# Altium project Player.PrjPcb (part 1 of 2)
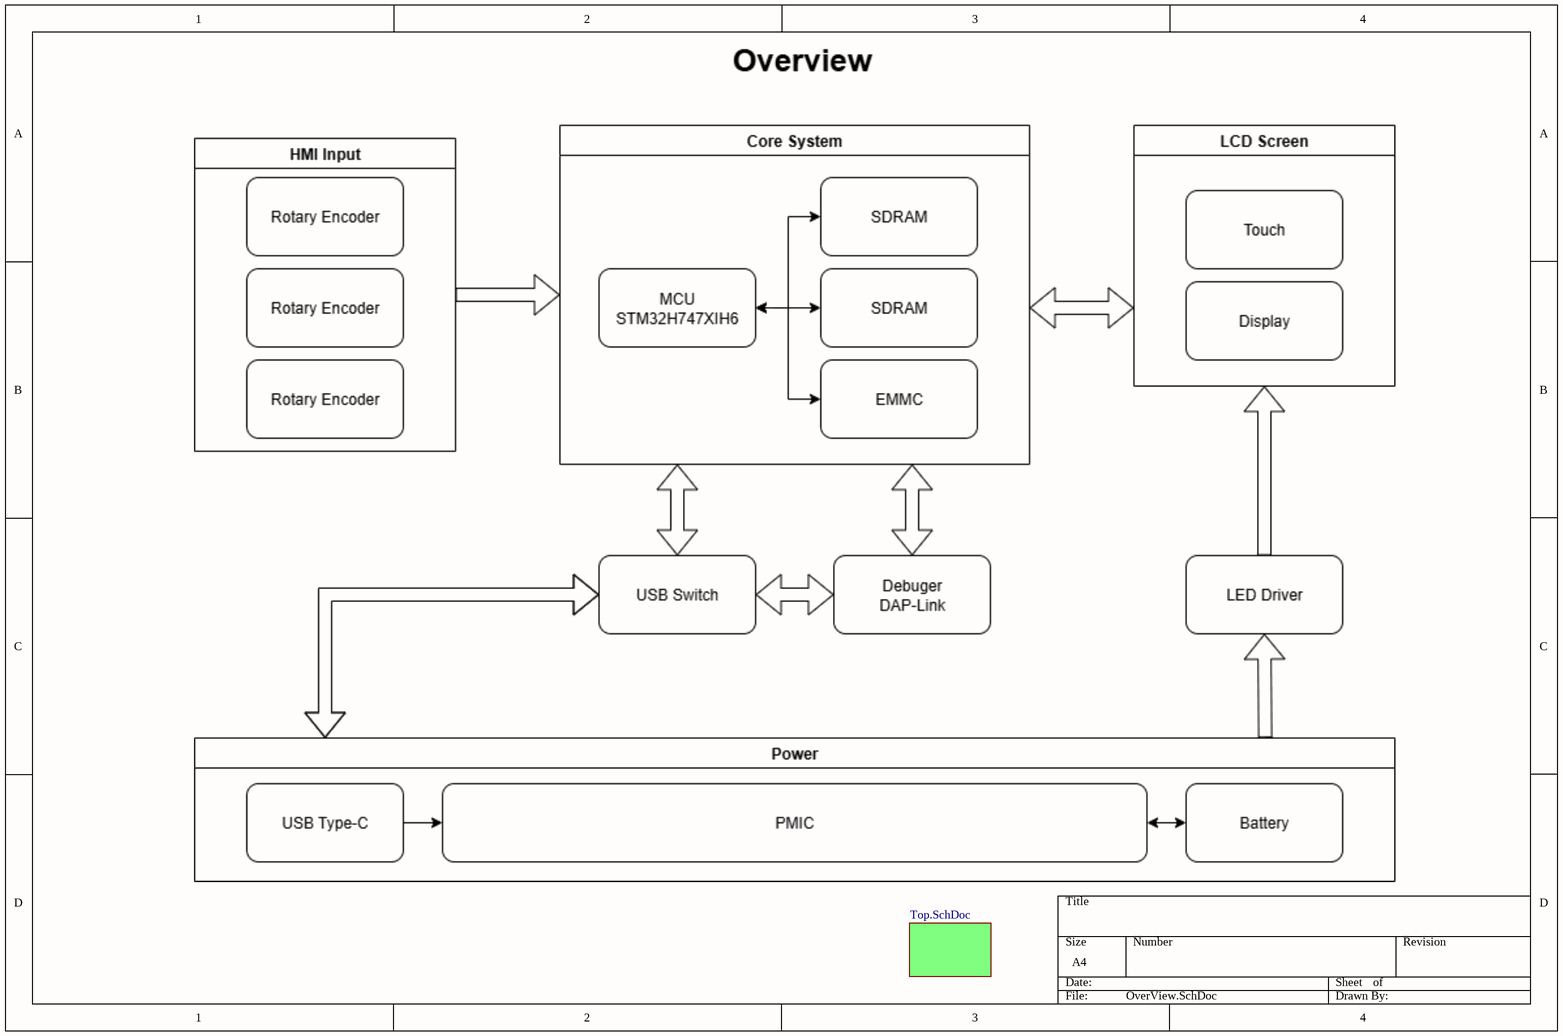
[diagram p0: OverView.SchDoc]
7 sheets, 265 parts. Net scope: flat (ports and power ports of the same name join across sheets).
Board files: Player.PcbDoc, Board.PcbDoc
Sheets:
  OverView.SchDoc
    Designator = Top.SchDoc
      MCU = MCU.SchDoc
      Analog Front End = AFE.SchDoc
      U_Nor Flash = Nor Flash QSPI.SchDoc
      U_EMMC = EMMC.SchDoc
      Audio I/V = Audio-HiFi.SchDoc
      Audio I/V = Audio-HiFi.SchDoc

## Sheet OverView.SchDoc
size A4; SheetNumber: 1; SheetTotal: 15

### Sub-sheets
Designator = Top.SchDoc: no entries

## Sheet Top.SchDoc
size A2; SheetNumber: 2; SheetTotal: 9
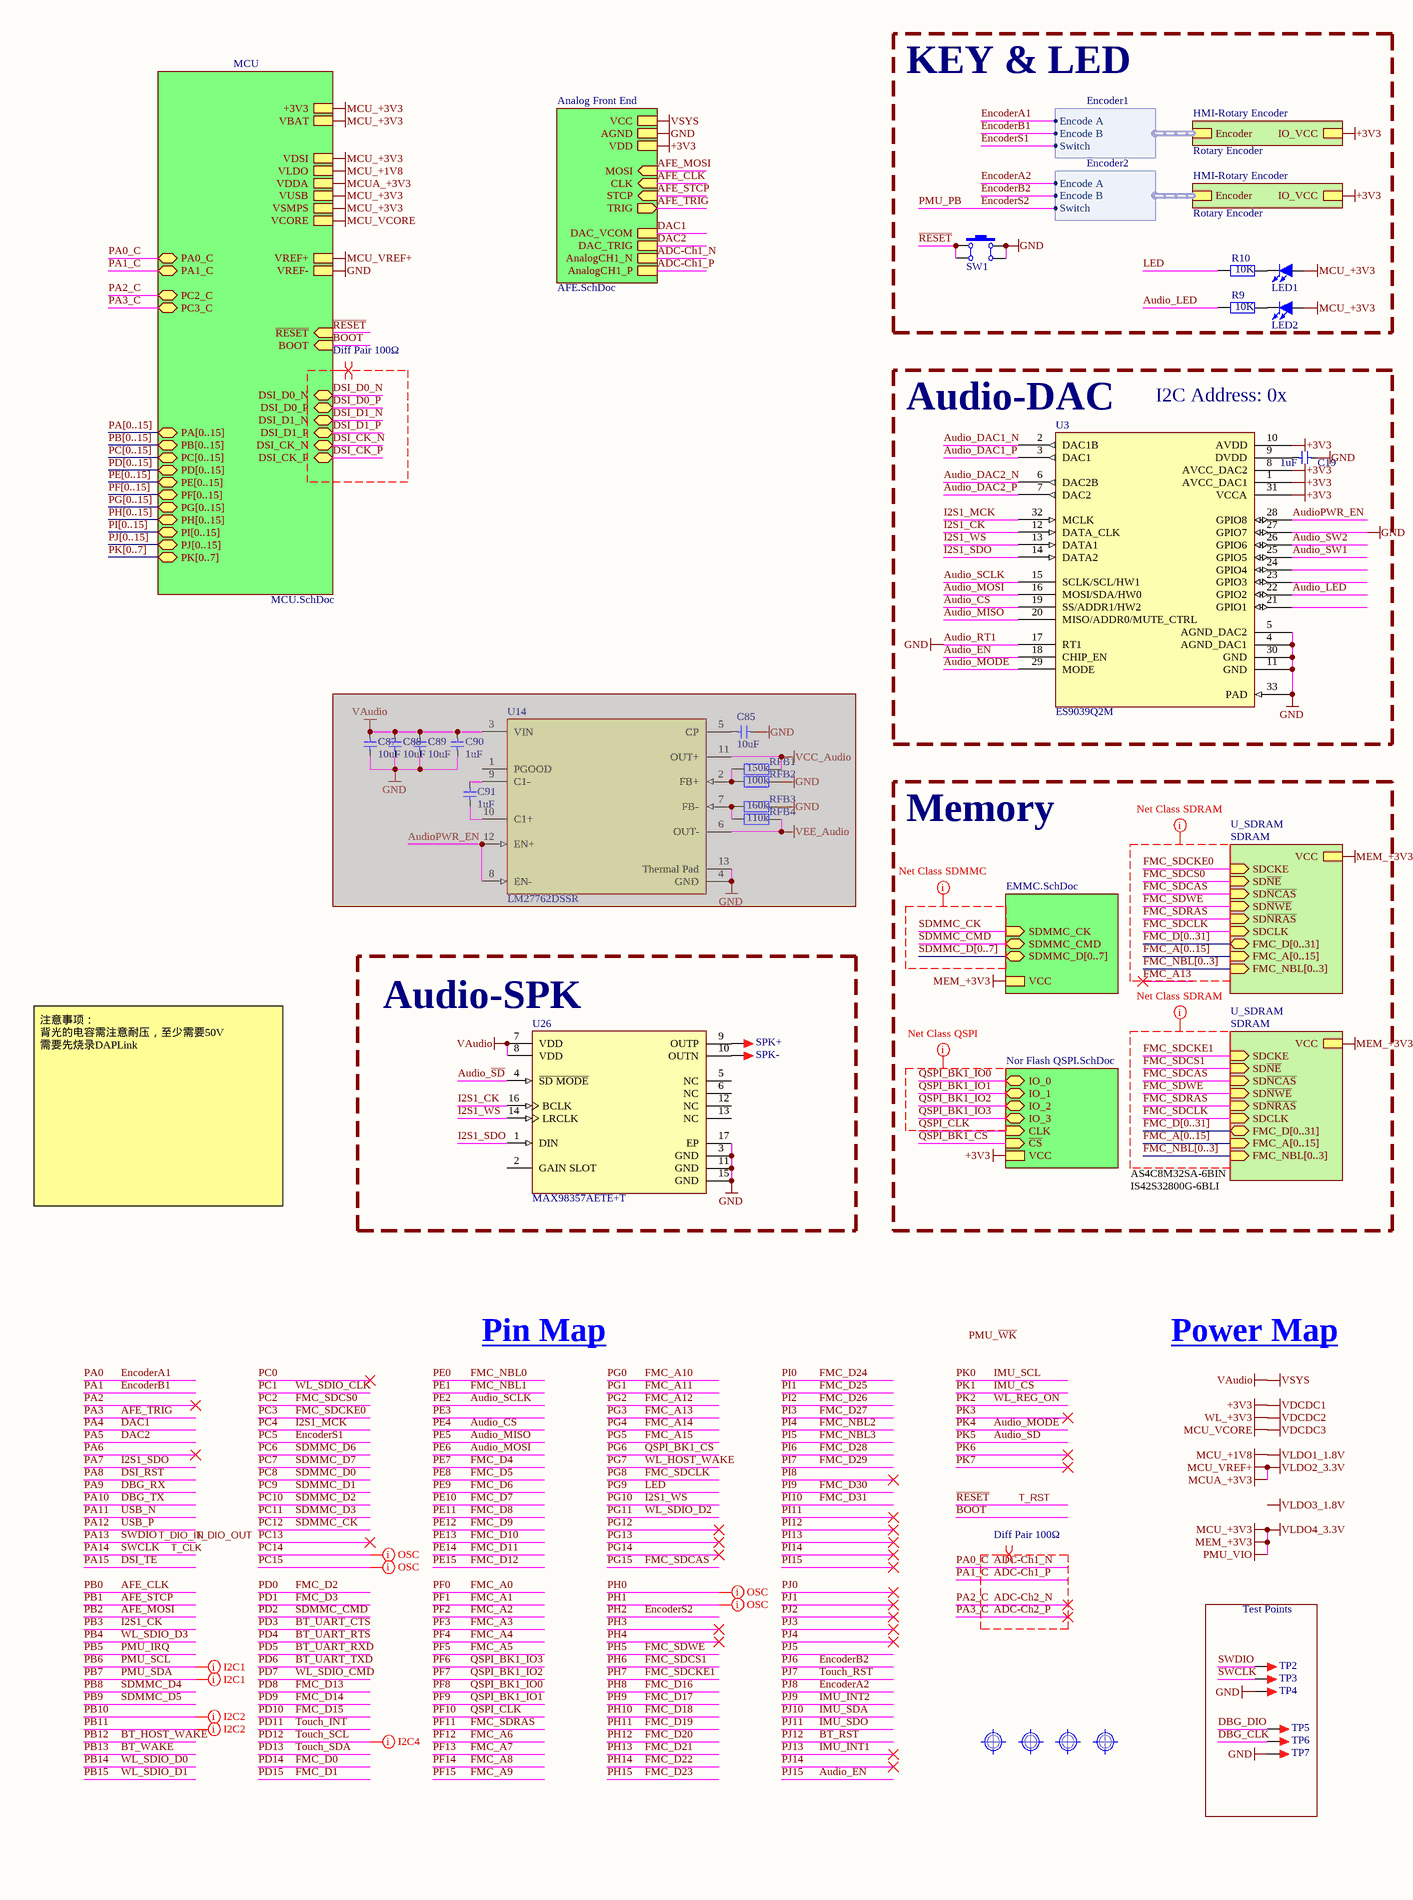
[diagram p1: Top.SchDoc, left]
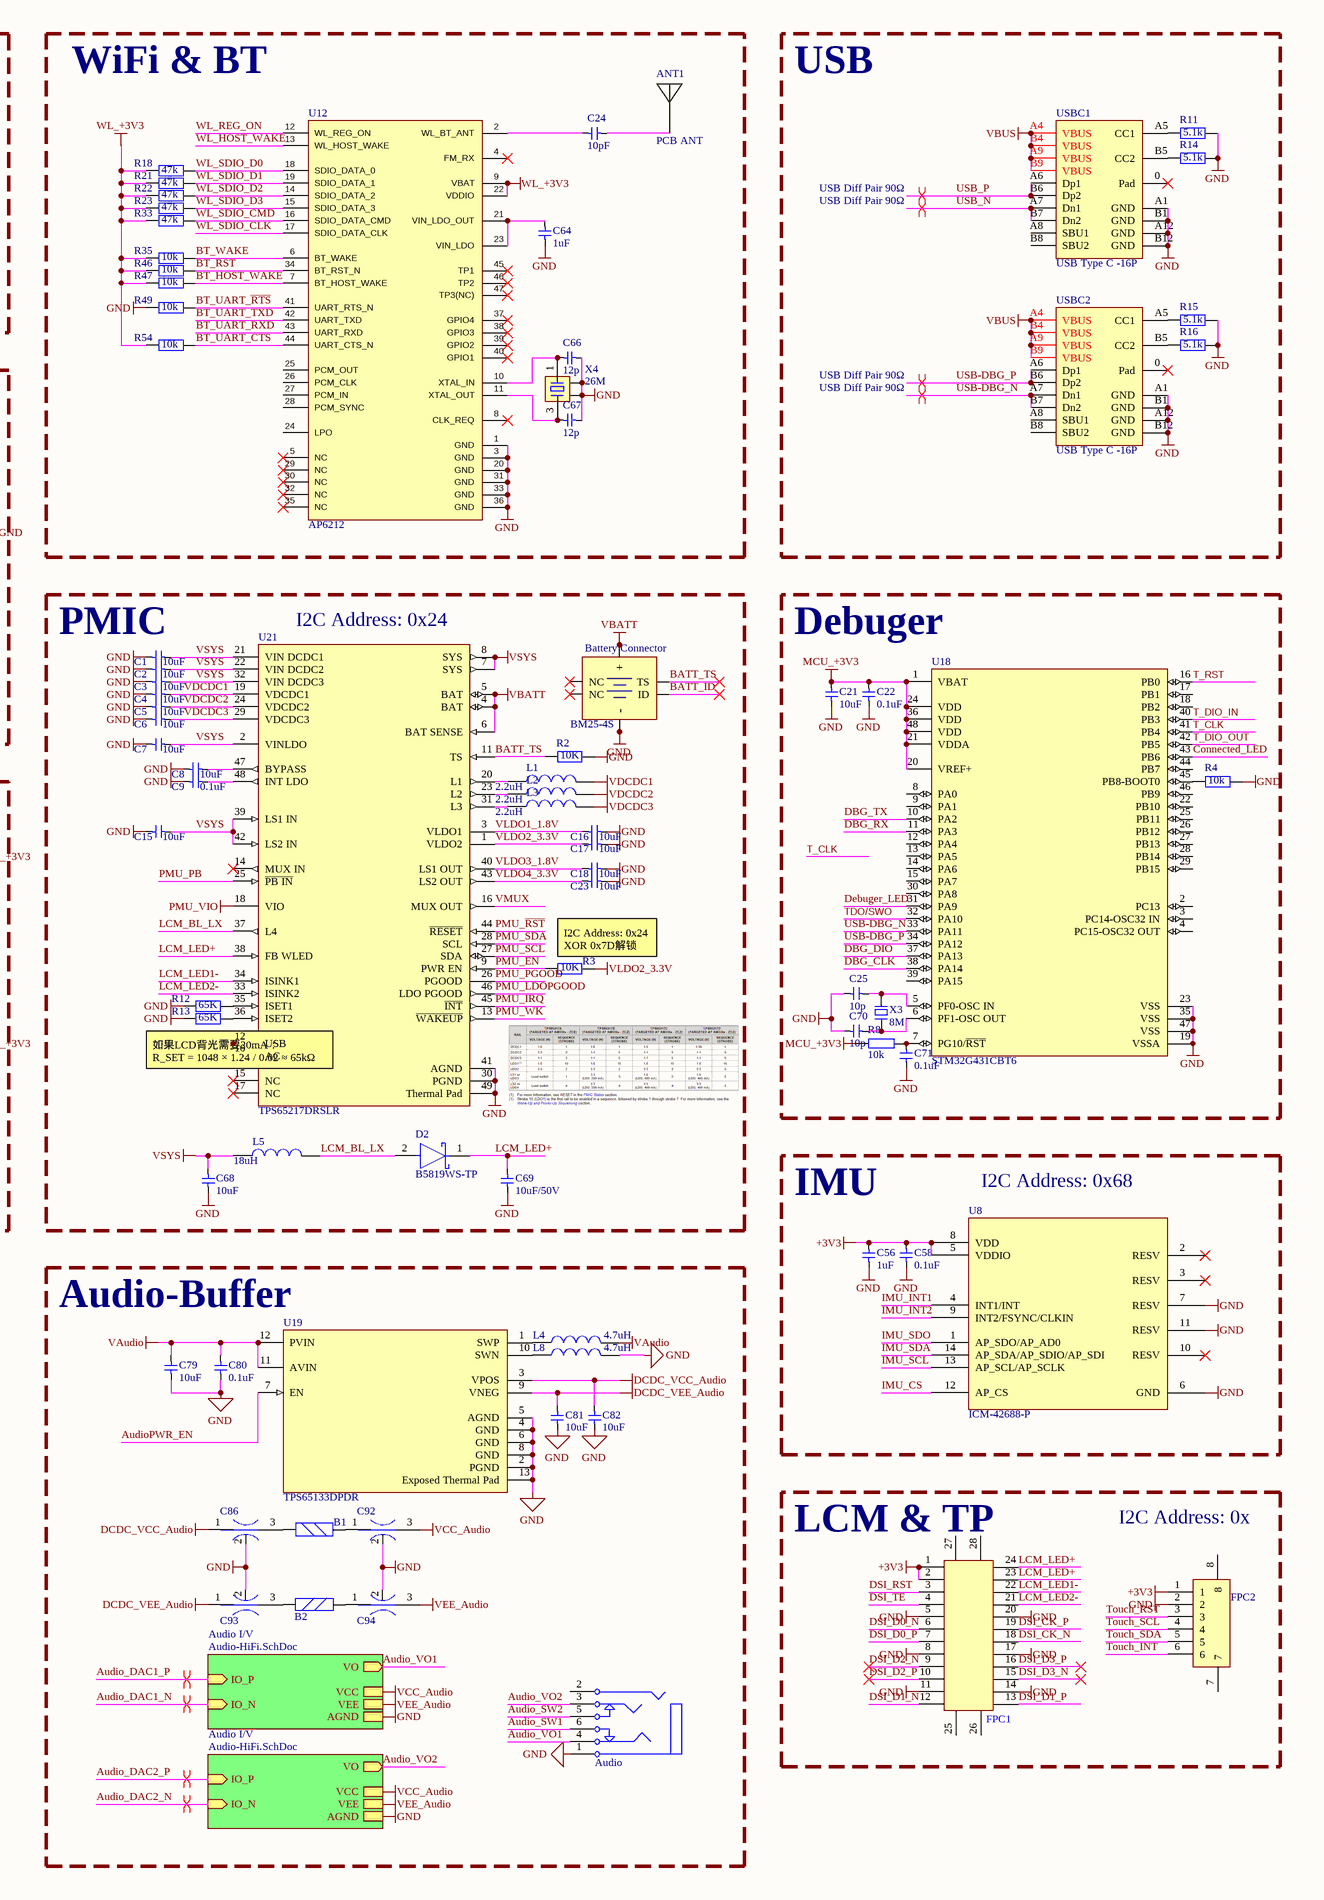
[diagram p2: Top.SchDoc, right]

### Parts
(Parts that share a designator on the sheet are numbered #1, #2 ... from top to bottom, then left to right.)
ANT1  PCB ANT  [WIFI-ANT]
Audio  PJ342  [PJ342A]  (value not drawn)
B1  BLM15AG601SN1D  [L0603]  (value not drawn)
B2  BLM15AG601SN1D  [L0603]  (value not drawn)
Battery_Connector  BM25-4S  [BM25-4S/2-V-51]
C1  10uF  [0603-C]
C2  10uF  [0603-C]
C3  10uF  [0603-C]
C4  10uF  [0603-C]
C5  10uF  [0603-C]
C6  10uF  [0603-C]
C7  10uF  [0603-C]
C8  10uF  [0603-C]
C9  0.1uF  [0603-C]
C15#1  10uF  [0603-C]
C16#1  10uF  [0603-C]
C17#1  10uF  [0603-C]
C18#1  10uF  [0603-C]
C19  1uF  [0402-C]
C21  10uF  [0402-C]
C22  0.1uF  [0402-C]
C23  10uF  [0603-C]
C24  10pF  [0402-C]
C25  10p  [0402-C]
C56  1uF  [0402-C]
C58  0.1uF  [0402-C]
C64  1uF  [0402-C]
C66  12p  [0402-C]
C67  12p  [0402-C]
C68  10uF  [0603-C]
C69  10uF/50V  [0603-C]
C70  10p  [0402-C]
C71  0.1uF  [0402-C]
C79  10uF  [0402-C]
C80  0.1uF  [0402-C]
C81  10uF  [0402-C]
C82  10uF  [0402-C]
C85  10uF  [0402-C]  (masked out: inside a compile mask, not in the netlist)
C86  NFM18PS105D0J3D  [FP-NFM18-0_1-e0_05_0_35-MFG]  (value not drawn)
C87  10uF  [0402-C]  (masked out: inside a compile mask, not in the netlist)
C88  10uF  [0402-C]  (masked out: inside a compile mask, not in the netlist)
C89  10uF  [0402-C]  (masked out: inside a compile mask, not in the netlist)
C90  1uF  [0402-C]  (masked out: inside a compile mask, not in the netlist)
C91  1uF  [0402-C]  (masked out: inside a compile mask, not in the netlist)
C92  NFM18PS105D0J3D  [FP-NFM18-0_1-e0_05_0_35-MFG]  (value not drawn)
C93  NFM18PS105D0J3D  [FP-NFM18-0_1-e0_05_0_35-MFG]  (value not drawn)
C94  NFM18PS105D0J3D  [FP-NFM18-0_1-e0_05_0_35-MFG]  (value not drawn)
D2  B5819WS-TP  [FP-SOD-323-IPC_C]
FPC1  OK-06F024-04  [OK-06F024-04]  (value not drawn)
FPC2  AFC01-S06FCA-00  [FPC-SMD_P0.50-6P_AFC01-S06FCA-00]  (value not drawn)
L1  2.2uH  [L0805]
L2  2.2uH  [L0805]
L3  2.2uH  [L0805]
L4  4.7uH  [L0805]
L5#1  18uH  [L0805]
L8  4.7uH  [L0805]
LED1  红色  [LED0603_B]  (value not drawn)
LED2  红色  [LED0603_B]  (value not drawn)
MR1  MARK1.6  [Mark 1]  (value not drawn)
MR2  MARK1.6  [Mark 1]  (value not drawn)
MR3  MARK1.6  [Mark 1]  (value not drawn)
MR4  MARK1.6  [Mark 1]  (value not drawn)
R2  10K  [0402-R]
R3  10K  [0603-R]
R4  10k  [0402-R]
R8  10k  [0402-R]
R9  10K  [0402-R]
R10  10K  [0402-R]
R11  5.1k  [0402-R]
R12  65K  [0402-R]
R13  65K  [0402-R]
R14  5.1k  [0402-R]
R15  5.1k  [0402-R]
R16  5.1k  [0402-R]
R18  47k  [0402-R]
R21  47k  [0402-R]
R22  47k  [0402-R]
R23  47k  [0402-R]
R33  47k  [0402-R]
R35  10k  [0402-R]
R46  10k  [0402-R]
R47  10k  [0402-R]
R49  10k  [0402-R]
R54  10k  [0402-R]
RFB1  150k  [0402-R]  (masked out: inside a compile mask, not in the netlist)
RFB2  100k  [0402-R]  (masked out: inside a compile mask, not in the netlist)
RFB3  160k  [0402-R]  (masked out: inside a compile mask, not in the netlist)
RFB4  110k  [0402-R]  (masked out: inside a compile mask, not in the netlist)
SPK+  (no value)  [SMD_L2.2-W1.0_KH-221020-TP]
SPK-  (no value)  [SMD_L2.2-W1.0_KH-221020-TP]
SW1  TD-1187SA-250  [SW-SMD-3.5*3.0_4P]  (value not drawn)
TP2  (no value)  [TEST 1]
TP3  (no value)  [TEST 1]
TP4  (no value)  [TEST 1]
TP5  (no value)  [SMD_L2.2-W1.0_KH-221020-TP]
TP6  (no value)  [SMD_L2.2-W1.0_KH-221020-TP]
TP7  (no value)  [TEST 1]
U3  ES9039Q2M  [QFN32 5x5_L]
U8  ICM-42688-P  [LGA-14_L3.0-W2.5-P0.50-TL]
U12  AP6212  [QFN-44_L12.0-W12.0-P0.90-TL]
U14  LM27762DSSR  [FP-DSS0012B-MFG]  (masked out: inside a compile mask, not in the netlist)
U18  STM32G431CBT6  [FP-LQFP48-5B-MFG]
U19  TPS65133DPDR  [FP-DPD0012A-MFG]
U21  TPS65217DRSLR  [FP-RSL0048A-MFG]
U26  MAX98357AETE+T  [FP-T1633-4-MFG]
USBC1  USB Type C -16P  [USB-C-SMD_16P]
USBC2  USB Type C -16P  [USB-C-SMD_16P]
X3  8M  [XTAL-3215-2P]
X4  26M  [XTAL-3225-4P]

### Blocks framed on the sheet
KEY & LED: LED1 LED2 R9 R10 SW1
WiFi & BT: ANT1 C24 C64 C66 C67 R18 R21-R23 R33 R35 R46 R47 R49 R54 U12 X4
USB: R11 R14-R16 USBC1 USBC2
Audio-DAC: C19 U3
PMIC: Battery_Connector C1-C9 C15#1 C16#1 C17#1 C18#1 C23 C68 C69 D2 L1-L3 L5#1 R2 R3 R12 R13 U21
Debuger: C21 C22 C25 C70 C71 R4 R8 U18 X3
Audio-SPK: SPK+ SPK- U26
IMU: C56 C58 U8
Audio-Buffer: Audio B1 B2 C79-C82 C86 C92-C94 L4 L8 U19
LCM & TP: FPC1 FPC2
Test Points: TP2-TP7

### Sub-sheets
Analog Front End = AFE.SchDoc: AGND, VCC, AnalogCH1_N, AnalogCH1_P, TRIG (out), MOSI (in), CLK (in), STCP (in), VDD, DAC_TRIG, DAC_VCOM
Audio I/V = Audio-HiFi.SchDoc: IO_N (in), IO_P (in), VO (out), VCC, VEE, AGND
Audio I/V = Audio-HiFi.SchDoc: IO_N (in), IO_P (in), VO (out), VCC, VEE, AGND
HMI-Rotary Encoder = Rotary Encoder (file not in this document): Encoder (harness Encoder1), IO_VCC
HMI-Rotary Encoder = Rotary Encoder (file not in this document): Encoder (harness Encoder2), IO_VCC
MCU = MCU.SchDoc: VREF+, +3V3, BOOT (in), ~{RESET} (in), PA[0..15] (bidir), PB[0..15] (bidir), PC[0..15] (bidir), PD[0..15] (bidir), PE[0..15] (bidir), PF[0..15] (bidir), PG[0..15] (bidir), PH[0..15] (bidir), PI[0..15] (bidir), PJ[0..15] (bidir), PK[0..7] (bidir), PA0_C (bidir), PA1_C (bidir), PC2_C (bidir), PC3_C (bidir), DSI_D0_N (bidir), DSI_D0_P (bidir), DSI_D1_N (bidir), DSI_D1_P (bidir), DSI_CK_N (bidir), DSI_CK_P (bidir), VBAT, VREF-, VDSI, VLDO, VDDA, VUSB, VSMPS, VCORE
U_EMMC = EMMC.SchDoc: SDMMC_D[0..7] (bidir), SDMMC_CMD (bidir), SDMMC_CK (in), VCC
U_Nor Flash = Nor Flash QSPI.SchDoc: IO_0 (bidir), IO_1 (bidir), IO_2 (bidir), IO_3 (bidir), CLK (in), ~{CS} (in), VCC
U_SDRAM = SDRAM (file not in this document): SD~{NCAS} (in), SD~{NWE} (in), SD~{NRAS} (in), SD~{NE} (in), SDCKE (in), SDCLK (in), FMC_D[0..31] (bidir), FMC_A[0..15] (in), FMC_NBL[0..3] (in), VCC
U_SDRAM = SDRAM (file not in this document): SD~{NCAS} (in), SD~{NWE} (in), SD~{NRAS} (in), SD~{NE} (in), SDCKE (in), SDCLK (in), FMC_D[0..31] (bidir), FMC_A[0..15] (in), FMC_NBL[0..3] (in), VCC

### Harnesses
Encoder1: Encode A, Encode B, Switch
Encoder2: Encode A, Encode B, Switch

### Nets
Audio_RT1: Audio.1 Battery_Connector.7(-) Battery_Connector.8(-) Battery_Connector.11(-) Battery_Connector.12(-) Battery_Connector.15(-) Battery_Connector.16(-) C1.2 C2.2 C3.2 C4.2 C5.2 C6.2 C7.2 C8.2 C9.2 C15#1.2 C16#1.1 C17#1.1 C18#1.1 C19.2 C21.1 C22.1 C23.1 C25.1 C56.1 C58.1 C64.1 C66.2 C67.2 C68.1 C69.1 C70.1 C71.2 C79.1 C80.1 C81.1 C82.1 C86.2(GND) C92.2(GND) C93.2(GND) C94.2(GND) FPC1.5 FPC1.8 FPC1.11 FPC1.14 FPC1.17 FPC1.20 FPC2.2 L8.2 R2.2 R4.1 R11.2 R12.1 R13.1 R14.2 R15.2 R16.2 R49.1 SW1.2 SW1.3 TP4.1 TP7.1 U3.4(AGND_DAC1) U3.5(AGND_DAC2) U3.11(GND) U3.17(RT1) U3.27(GPIO7) U3.30(GND) U3.33(PAD) U8.6(GND) U8.7(RESV) U8.11(RESV) U12.1(GND) U12.3(GND) U12.20(GND) U12.31(GND) U12.33(GND) U12.36(GND) U18.19(VSSA) U18.23(VSS) U18.35(VSS) U18.47(VSS) U19.2(PGND) U19.4(GND) U19.5(AGND) U19.6(GND) U19.8(GND) U19.13(Exposed_Thermal_Pad) U21.30(PGND) U21.41(AGND) U21.49(Thermal_Pad) U26.3(GND) U26.11(GND) U26.15(GND) U26.17(EP) USBC1.A1(GND) USBC1.A12(GND) USBC1.B1(GND) USBC1.B12(GND) USBC2.A1(GND) USBC2.A12(GND) USBC2.B1(GND) USBC2.B12(GND) X4.2 X4.4 ; sheet MCU/VREF-, sheet Analog Front End/AGND, sheet Audio I/V/AGND, sheet Audio I/V/AGND  [also labelled GND]
DCDC_VCC_Audio: C82.2 C86.1(Input) U19.3(VPOS)
DCDC_VEE_Audio: C81.2 C93.1(Input) U19.9(VNEG)
VBATT: Battery_Connector.1(+) Battery_Connector.2(+) Battery_Connector.9(+) Battery_Connector.10(+) Battery_Connector.13(+) Battery_Connector.14(+) U21.4(BAT) U21.5(BAT) U21.6(BAT_SENSE)
VBUS: U21.10(AC) U21.12(USB) USBC1.A4(VBUS) USBC1.A9(VBUS) USBC1.B4(VBUS) USBC1.B9(VBUS) USBC2.A4(VBUS) USBC2.A9(VBUS) USBC2.B4(VBUS) USBC2.B9(VBUS)
VCC_Audio: C92.3(Output) ; sheet Audio I/V/VCC, sheet Audio I/V/VCC
VDCDC1: C4.1 C56.2 C58.2 FPC1.1 FPC1.2 FPC2.1 L1.2 U3.1(AVCC_DAC1) U3.8(AVCC_DAC2) U3.10(AVDD) U3.31(VCCA) U8.5(VDDIO) U8.8(VDD) U21.19(VDCDC1) ; sheet HMI-Rotary Encoder/IO_VCC, sheet HMI-Rotary Encoder/IO_VCC, sheet Analog Front End/VDD, sheet U_Nor Flash/VCC  [also labelled +3V3]
VDCDC2: C5.1 L2.2 R18.1 R21.1 R22.1 R23.1 R33.1 R35.1 R46.1 R47.1 R54.1 U12.9(VBAT) U12.22(VDDIO) U21.24(VDCDC2)  [also labelled WL_+3V3]
VDCDC3: C6.1 L3.2 U21.29(VDCDC3) ; sheet MCU/VCORE  [also labelled MCU_VCORE]
VEE_Audio: C94.3(Output) ; sheet Audio I/V/VEE, sheet Audio I/V/VEE
VLDO1_1.8V: C16#1.2 U21.3(VLDO1) ; sheet MCU/VLDO  [also labelled MCU_+1V8]
VLDO2_3.3V: C17#1.2 R3.2 U21.1(VLDO2) ; sheet MCU/VREF+, sheet MCU/VDDA  [also labelled MCU_VREF+, MCUA_+3V3]
VLDO3_1.8V: C18#1.2 U21.40(LS1_OUT)
VLDO4_3.3V: C21.2 C22.2 C23.2 LED1.1(A) LED2.1(A) R8.1 U18.1(VBAT) U18.20(VREF+) U18.21(VDDA) U18.24(VDD) U18.36(VDD) U18.48(VDD) U21.18(VIO) U21.43(LS2_OUT) ; sheet MCU/+3V3, sheet MCU/VBAT, sheet MCU/VDSI, sheet MCU/VUSB, sheet MCU/VSMPS, sheet U_SDRAM/VCC, sheet U_SDRAM/VCC, sheet U_EMMC/VCC  [also labelled MCU_+3V3, MEM_+3V3, PMU_VIO]
VSYS: C1.1 C2.1 C3.1 C7.1 C15#1.1 C68.2 C79.2 C80.2 L4.2 L5#1.1 U19.11(AVIN) U19.12(PVIN) U21.2(VINLDO) U21.7(SYS) U21.8(SYS) U21.21(VIN_DCDC1) U21.22(VIN_DCDC2) U21.32(VIN_DCDC3) U21.39(LS1_IN) U21.42(LS2_IN) U26.7(VDD) U26.8(VDD) ; sheet Analog Front End/VCC  [also labelled VAudio]
ADC-Ch1_N: sheet MCU/PA0_C, sheet Analog Front End/AnalogCH1_N  [also labelled PA0_C]
ADC-Ch1_P: sheet MCU/PA1_C, sheet Analog Front End/AnalogCH1_P  [also labelled PA1_C]
ADC-Ch2_N: sheet MCU/PC2_C  [also labelled PA2_C]
ADC-Ch2_P: sheet MCU/PC3_C  [also labelled PA3_C]
AFE_CLK: sheet Analog Front End/CLK  [also labelled PB0]
AFE_MOSI: sheet Analog Front End/MOSI  [also labelled PB2]
AFE_STCP: sheet Analog Front End/STCP  [also labelled PB1]
AFE_TRIG: sheet Analog Front End/TRIG  [also labelled PA3]
Audio_CS: U3.19(SS/ADDR1/HW2)  [also labelled PE4]
Audio_DAC1_N: U3.2(DAC1B) ; sheet Audio I/V/IO_N
Audio_DAC1_P: U3.3(DAC1) ; sheet Audio I/V/IO_P
Audio_DAC2_N: U3.6(DAC2B) ; sheet Audio I/V/IO_N
Audio_DAC2_P: U3.7(DAC2) ; sheet Audio I/V/IO_P
Audio_EN: U3.18(CHIP_EN)  [also labelled PJ15]
Audio_LED: R9.1 U3.22(GPIO2)
Audio_MISO: U3.20(MISO/ADDR0/MUTE_CTRL)  [also labelled PE5]
Audio_MODE: U3.29(MODE)  [also labelled PK4]
Audio_MOSI: U3.16(MOSI/SDA/HW0)  [also labelled PE6]
Audio_~{SD}: U26.4(~{SD_MODE})  [also labelled PK5]
Audio_SCLK: U3.15(SCLK/SCL/HW1)  [also labelled PE2]
Audio_SW1: Audio.6 U3.25(GPIO5)
Audio_SW2: Audio.5 U3.26(GPIO6)
Audio_VO1: Audio.4 ; sheet Audio I/V/VO
Audio_VO2: Audio.3 ; sheet Audio I/V/VO
AudioPWR_EN: U3.28(GPIO8) U19.7(EN)
BATT_ID: Battery_Connector.4(ID)
BATT_TS: Battery_Connector.3(TS) R2.1 U21.11(TS)
BOOT: sheet MCU/BOOT
BT_HOST_WAKE: R47.2 U12.7(BT_HOST_WAKE)  [also labelled PB12]
BT_~{RST}: R46.2 U12.34(BT_RST_N)  [also labelled PJ12]
BT_UART_~{CTS}: R54.2 U12.44(UART_CTS_N)  [also labelled PD3]
BT_UART_~{RTS}: R49.2 U12.41(UART_RTS_N)  [also labelled PD4]
BT_UART_RXD: U12.43(UART_RXD)  [also labelled PD5]
BT_UART_TXD: U12.42(UART_TXD)  [also labelled PD6]
BT_WAKE: R35.2 U12.6(BT_WAKE)  [also labelled PB13]
Connected_LED: U18.43(PB6)
DAC1: sheet Analog Front End/DAC_VCOM  [also labelled PA4]
DAC2: sheet Analog Front End/DAC_TRIG  [also labelled PA5]
DBG_CLK: TP6.1 U18.38(PA14)
DBG_DIO: TP5.1 U18.37(PA13)
DBG_RX: U18.11(PA3)  [also labelled PA9]
DBG_TX: U18.10(PA2)  [also labelled PA10]
Debuger_LED: U18.31(PA9)
DSI_CK_N: FPC1.18 ; sheet MCU/DSI_CK_N
DSI_CK_P: FPC1.19 ; sheet MCU/DSI_CK_P
DSI_D0_N: FPC1.6 ; sheet MCU/DSI_D0_N
DSI_D0_P: FPC1.7 ; sheet MCU/DSI_D0_P
DSI_D1_N: FPC1.12 ; sheet MCU/DSI_D1_N
DSI_D1_P: FPC1.13 ; sheet MCU/DSI_D1_P
DSI_D2_N: FPC1.9
DSI_D2_P: FPC1.10
DSI_D3_N: FPC1.15
DSI_D3_P: FPC1.16
DSI_RST: FPC1.3  [also labelled PA8]
DSI_TE: FPC1.4  [also labelled PA15]
EncoderA1: sheet HMI-Rotary Encoder/Encoder.Encode A  [also labelled PA0]
EncoderA2: sheet HMI-Rotary Encoder/Encoder.Encode A  [also labelled PJ8]
EncoderB1: sheet HMI-Rotary Encoder/Encoder.Encode B  [also labelled PA1]
EncoderB2: sheet HMI-Rotary Encoder/Encoder.Encode B  [also labelled PJ6]
EncoderS1: sheet HMI-Rotary Encoder/Encoder.Switch  [also labelled PC5]
EncoderS2: U21.25(~{PB_IN}) ; sheet HMI-Rotary Encoder/Encoder.Switch  [also labelled PH2, PMU_PB]
FMC_SD~{CAS}: sheet U_SDRAM/SD~{NCAS}, sheet U_SDRAM/SD~{NCAS}  [also labelled PG15]
FMC_SD~{CS}0: sheet U_SDRAM/SD~{NE}  [also labelled PC2]
FMC_SD~{CS}1: sheet U_SDRAM/SD~{NE}  [also labelled PH6]
FMC_SDCKE0: sheet U_SDRAM/SDCKE  [also labelled PC3]
FMC_SDCKE1: sheet U_SDRAM/SDCKE  [also labelled PH7]
FMC_SDCLK: sheet U_SDRAM/SDCLK, sheet U_SDRAM/SDCLK  [also labelled PG8]
FMC_SD~{RAS}: sheet U_SDRAM/SD~{NRAS}, sheet U_SDRAM/SD~{NRAS}  [also labelled PF11]
FMC_SD~{WE}: sheet U_SDRAM/SD~{NWE}, sheet U_SDRAM/SD~{NWE}  [also labelled PH5]
I2S1_CK: U3.12(DATA_CLK) U26.16(BCLK)  [also labelled PB3]
I2S1_MCK: U3.32(MCLK)  [also labelled PC4]
I2S1_SDO: U3.14(DATA2) U26.1(DIN)  [also labelled PA7]
I2S1_WS: U3.13(DATA1) U26.14(LRCLK)  [also labelled PG10]
IMU_CS: U8.12(AP_CS)  [also labelled PK1]
IMU_INT1: U8.4(INT1/INT)  [also labelled PJ13]
IMU_INT2: U8.9(INT2/FSYNC/CLKIN)  [also labelled PJ9]
IMU_SCL: U8.13(AP_SCL/AP_SCLK)  [also labelled PK0]
IMU_SDA: U8.14(AP_SDA/AP_SDIO/AP_SDI)  [also labelled PJ10]
IMU_SDO: U8.1(AP_SDO/AP_AD0)  [also labelled PJ11]
LCM_BL_LX: D2.2(A) L5#1.2 U21.37(L4)
LCM_LED1-: FPC1.22 U21.34(ISINK1)
LCM_LED2-: FPC1.21 U21.33(ISINK2)
LCM_LED+: C69.2 D2.1(C) FPC1.23 FPC1.24 U21.38(FB_WLED)
LED: R10.1  [also labelled PG9]
PA11: USBC1.A7(Dn1) USBC1.B7(Dn2)  [also labelled USB_N]
PA12: USBC1.A6(Dp1) USBC1.B6(Dp2)  [also labelled USB_P]
PA13: TP2.1 U18.40(PB3) U18.42(PB5)  [also labelled SWDIO, T_DIO_IN, T_DIO_OUT]
PA14: TP3.1 U18.41(PB4)  [also labelled SWCLK, T_CLK]
PB4: R23.2 U12.15(SDIO_DATA_3)  [also labelled WL_SDIO_D3]
PB5: U21.45(~{INT})  [also labelled PMU_~{IRQ}]
PB6: U21.27(SDA)  [also labelled PMU_SCL]
PB7: U21.28(SCL)  [also labelled PMU_SDA]
PB14: R18.2 U12.18(SDIO_DATA_0)  [also labelled WL_SDIO_D0]
PB15: R21.2 U12.19(SDIO_DATA_1)  [also labelled WL_SDIO_D1]
PC1: U12.17(SDIO_DATA_CLK)  [also labelled WL_SDIO_CLK]
PC12: sheet U_EMMC/SDMMC_CK  [also labelled SDMMC_CK]
PD2: sheet U_EMMC/SDMMC_CMD  [also labelled SDMMC_CMD]
PD7: R33.2 U12.16(SDIO_DATA_CMD)  [also labelled WL_SDIO_CMD]
PD11: FPC2.6  [also labelled Touch_INT]
PD12: FPC2.4  [also labelled Touch_SCL]
PD13: FPC2.5  [also labelled Touch_SDA]
PF6: sheet U_Nor Flash/IO_3  [also labelled QSPI_BK1_IO3]
PF7: sheet U_Nor Flash/IO_2  [also labelled QSPI_BK1_IO2]
PF8: sheet U_Nor Flash/IO_0  [also labelled QSPI_BK1_IO0]
PF9: sheet U_Nor Flash/IO_1  [also labelled QSPI_BK1_IO1]
PF10: sheet U_Nor Flash/CLK  [also labelled QSPI_CLK]
PG6: sheet U_Nor Flash/~{CS}  [also labelled QSPI_BK1_~{CS}]
PG7: U12.13(WL_HOST_WAKE)  [also labelled WL_HOST_WAKE]
PG11: R22.2 U12.14(SDIO_DATA_2)  [also labelled WL_SDIO_D2]
PJ7: FPC2.3  [also labelled Touch_RST]
PK2: U12.12(WL_REG_ON)  [also labelled WL_REG_ON]
PMU_EN: R3.1 U21.9(PWR_EN)
PMU_LDOPGOOD: U21.46(LDO_PGOOD)
PMU_PGOOD: U21.26(PGOOD)
PMU_~{RST}: U21.44(~{RESET})
PMU_~{WK}: U21.13(~{WAKEUP})
~{RESET}: SW1.1 SW1.4 U18.16(PB0) ; sheet MCU/~{RESET}  [also labelled T_RST]
TDO/SWO: U18.32(PA10)
USB-DBG_N: U18.33(PA11) USBC2.A7(Dn1) USBC2.B7(Dn2)
USB-DBG_P: U18.34(PA12) USBC2.A6(Dp1) USBC2.B6(Dp2)
VMUX: U21.16(MUX_OUT)
NetANT1_1: ANT1.1 C24.2
NetB1_1: B1.1 C92.1(Input)
NetB1_2: B1.2 C86.3(Output)
NetB2_1: B2.1 C94.1(Input)
NetB2_2: B2.2 C93.3(Output)
NetC8_1: C8.1 U21.47(BYPASS)
NetC9_1: C9.1 U21.48(INT_LDO)
NetC19_1: C19.1 U3.9(DVDD)
NetC24_1: C24.1 U12.2(WL_BT_ANT)
NetC25_2: C25.2 U18.5(PF0-OSC_IN) X3.2
NetC64_2: C64.2 U12.21(VIN_LDO_OUT) U12.23(VIN_LDO)
NetC66_1: C66.1 U12.10(XTAL_IN) X4.1
NetC67_1: C67.1 U12.11(XTAL_OUT) X4.3
NetC70_2: C70.2 U18.6(PF1-OSC_OUT) X3.1
NetC71_1: C71.1 R8.2 U18.7(PG10/~{RST})
NetL1_1: L1.1 U21.20(L1)
NetL2_1: L2.1 U21.23(L2)
NetL3_1: L3.1 U21.31(L3)
NetL4_1: L4.1 U19.1(SWP)
NetL8_1: L8.1 U19.10(SWN)
NetLED1_2: LED1.2(K) R10.2
NetLED2_2: LED2.2(K) R9.2
NetR4_2: R4.2 U18.45(PB8-BOOT0)
NetR11_1: R11.1 USBC1.A5(CC1)
NetR12_2: R12.2 U21.35(ISET1)
NetR13_2: R13.2 U21.36(ISET2)
NetR14_1: R14.1 USBC1.B5(CC2)
NetR15_1: R15.1 USBC2.A5(CC1)
NetR16_1: R16.1 USBC2.B5(CC2)
NetSPK+_1: SPK+.1 U26.9(OUTP)
NetSPK-_1: SPK-.1 U26.10(OUTN)

Not connected (* = marked no-connect by the designer): Audio 2; Battery_Connector 5(NC)* 6(NC)*; FPC1 25 26 27 28; FPC2 7 8; U3 21(GPIO1) 23(GPIO3) 24(GPIO4); U8 2(RESV)* 3(RESV)* 10(RESV)*; U12 4(FM_RX)* 5(NC)* 8(CLK_REQ)* 24(LPO) 25(PCM_OUT) 26(PCM_CLK) 27(PCM_IN) 28(PCM_SYNC) 29(NC)* 30(NC)* 32(NC)* 35(NC)* 37(GPIO4)* 38(GPIO3)* 39(GPIO2)* 40(GPIO1)* 45(TP1)* 46(TP2)* 47(TP3(NC))*; U18 2(PC13) 3(PC14-OSC32_IN) 4(PC15-OSC32_OUT) 8(PA0) 9(PA1) 12(PA4) 13(PA5) 14(PA6) 15(PA7) 17(PB1) 18(PB2) 22(PB10) 25(PB11) 26(PB12) 27(PB13) 28(PB14) 29(PB15) 30(PA8) 39(PA15) 44(PB7) 46(PB9); U21 14(MUX_IN)* 15(NC)* 17(NC)*; U26 2(GAIN_SLOT) 5(NC) 6(NC) 12(NC) 13(NC); USBC1 0(Pad)* A8(SBU1) B8(SBU2); USBC2 0(Pad)* A8(SBU1) B8(SBU2)

### Buses and harness runs
bus FMC_A[0..15] = sheet U_SDRAM/FMC_A[0..15]
bus FMC_D[0..31] = sheet U_SDRAM/FMC_D[0..31]
bus FMC_NBL[0..3] = sheet U_SDRAM/FMC_NBL[0..3]
bus PA[0..15] = sheet MCU/PA[0..15]
bus PB[0..15] = sheet MCU/PB[0..15]
bus PC[0..15] = sheet MCU/PC[0..15]
bus PD[0..15] = sheet MCU/PD[0..15]
bus PE[0..15] = sheet MCU/PE[0..15]
bus PF[0..15] = sheet MCU/PF[0..15]
bus PG[0..15] = sheet MCU/PG[0..15]
bus PH[0..15] = sheet MCU/PH[0..15]
bus PI[0..15] = sheet MCU/PI[0..15]
bus PJ[0..15] = sheet MCU/PJ[0..15]
bus PK[0..7] = sheet MCU/PK[0..7]
bus SDMMC_D[0..7] = sheet U_EMMC/SDMMC_D[0..7]

### Layout directives
differential pair; Parameter 1: Diff Pair 100Ω; rule Differential Pairs Routing [Pref Gap = 6mil    Min Gap  = 4mil    Max Gap  = 10milPref Width = 6mil    Min Width  = 4mil    Max Width  = 15mil]; differential pair class MIPI; net class MIPI; rule Matched Net Lengths [Tolerance = 50mil]: DSI_CK_N, DSI_CK_P, DSI_D0_N, DSI_D0_P, DSI_D1_N, DSI_D1_P
differential pair; Parameter 1: Diff Pair 100Ω; rule Differential Pairs Routing [Pref Gap = 6mil    Min Gap  = 4mil    Max Gap  = 10milPref Width = 6mil    Min Width  = 4mil    Max Width  = 15mil]; differential pair class ADC; net class ADC; rule Matched Net Lengths [Tolerance = 50mil]: ADC-Ch1_N, ADC-Ch1_P, ADC-Ch2_N, ADC-Ch2_P
net class SDRAM1: FMC_A13, FMC_A[0..15], FMC_D[0..31], FMC_NBL[0..3], FMC_SDCKE0, FMC_SDCLK, FMC_SD~{CAS}, FMC_SD~{CS}0, FMC_SD~{RAS}, FMC_SD~{WE}
net class QSPI; rule Matched Net Lengths [Tolerance = 100mil]: QSPI_BK1_IO0, QSPI_BK1_IO1, QSPI_BK1_IO2, QSPI_BK1_IO3, QSPI_CLK
net class SDMMC; rule Matched Net Lengths [Tolerance = 100mil]: SDMMC_CK, SDMMC_CMD, SDMMC_D[0..7]
net class SDRAM2: FMC_A[0..15], FMC_D[0..31], FMC_NBL[0..3], FMC_SDCKE1, FMC_SDCLK, FMC_SD~{CAS}, FMC_SD~{CS}1, FMC_SD~{RAS}, FMC_SD~{WE}
I2C Address:: 0X: PB6, PC14, PC15, PH0, PH1
mark named I2C1: PB7
mark named I2C2: PB10, PB11
differential pair; Parameter 1: USB Diff Pair 90Ω; rule Differential Pairs Routing [Pref Gap = 6mil    Min Gap  = 4mil    Max Gap  = 10milPref Width = 6mil    Min Width  = 4mil    Max Width  = 15mil]; differential pair class USB: PA11, PA12, USB-DBG_N, USB-DBG_P
differential pair: Audio_DAC1_N, Audio_DAC1_P, Audio_DAC2_N, Audio_DAC2_P
mark named I2C4: PD12

### Notes on the sheet
- I2C Address: 0x
- (near U21) I2C Address: 0x24
- Memory
- (near R3) I2C Address: 0x24
  XOR 0x7D解锁
- (near U21) 如果LCD背光需要20mA：
  R_SET = 1048 × 1.24 / 0.02 ≈ 65kΩ
- 注意事项：
  背光的电容需注意耐压，至少需要50V
  需要先烧录DAPLink
- AS4C8M32SA-6BIN
  IS42S32800G-6BLI
- I2C Address: 0x68
- Pin Map
- Power Map
- Labels drawn without touching a wire or pin: PMU_~{WK}, VLDO3_1.8V

### Library data of the parts
ANT1 = ANT1: PCB板载天线; 当前库版本V2023.8.14 @淘宝卖家:黄晶宝石: 最新版本发布https://item.taobao.com/item.htm?id=566775463719; 联系下单店铺卖家 免费技术支持: 联系下单店铺卖家 免费帮你查找封装; BOM名称: PCB板载天线
Audio = PJ342: 3.5耳机插座,4Pin; BOM名称: 耳机插座; 当前库版本V2023.8.14 @淘宝卖家:黄晶宝石: 最新版本发布https://item.taobao.com/item.htm?id=566775463719
B1 B2 = BEAD
Battery_Connector = BM25-4S/2-V-51: Battery
C1-C9 C15#1 C16#1 C17#1 C18#1 C19 C21-C25 C56 C58 C64 C66-C71 C79-C82 C85 C87-C91 = 电容-0402: Capacitor; Value: 0.1u
C86 C92-C94 = CMP-06053-000028-1: CAP FEEDTHRU 1UF 20% 6.3V 0603; DC Resistance (DCR): 30mR; Current: 2A; Length: 0.063inch; Package Quantity: 4000; Capacitance: 1uF; Height: 0.028inch; Mount: Surface Mount; Max Operating Temperature: 125°C; Voltage Rating: 6.3V; Case/Package: 0603; Tolerance: 20%; Case Code (Metric): 1608; Min Operating Temperature: -55°C; Packaging: Tape and Reel; Case Code (Imperial): 0603; Voltage Rating (DC): 6.3V; Width: 0.031inch
D2 = CMP-56206-000009-1: DIODE SCHOTTKY 40V 1A SOD323; Max Reverse Leakage Current: 1mA; Peak Non-Repetitive Surge Current: 10A; Forward Voltage: 900mV; Element Configuration: Single; Max Reverse Voltage (DC): 40V; Number of Pins: 2; Max Operating Temperature: 125°C; Package Quantity: 1; Radiation Hardening: No; Average Rectified Current: 1A; Lead Free: Lead Free; Series: -; Mount: Surface Mount; Min Operating Temperature: -65°C; RoHS Compliant: Yes; Packaging: Tape and Reel; Max Surge Current: 10A
FPC1 = OK-06F024-04: Convert to PCB: yes; Symbol: OK-06F024-04; Device: OK-06F024-04; Add into BOM: yes
FPC2 = AFC01-S06FCA-00: Manufacturer: JS(钜硕电子); Add into BOM: yes; Locking Feature: 翻盖式; Number of Contacts: 6P; Pitch: 0.5mm; FFC, FCB Thickness: 0.3mm; Symbol: AFC01-S06FCA-00; Device: AFC01-S06FCA-00; Supplier: LCSC; Supplier Part: C262655; Manufacturer Part: AFC01-S06FCA-00; JLCPCB Part Class: 扩展库; LCSC Part Name: 间距:0.5mm P数:6P 翻盖式 下接; Supplier Footprint: SMD,P=0.5mm,卧贴; Datasheet: https://atta.szlcsc.com/upload/public/pdf/source/20190816/C413942_2A72D1AC756EAE17EEDF756A339D4500.pdf; Convert to PCB: yes; Contact Type: 下接; Mounting Type: 卧贴; Height Above Board: 2mm
L1-L4 L5#1 L8 = L: 贴片小功率电感; BOM名称: 小功率贴片电感; 联系下单店铺卖家 免费帮你查找封装: 联系下单店铺卖家 免费技术支持
LED1 LED2 = LED-SMD: 贴片LED; 联系卖家 免费查找封装: 封装库来自淘宝卖家ID：黄晶宝石; BOM名称: 贴片LED
MR1-MR4 = MARK: 光学定位点; 联系下单店铺卖家 免费技术支持: 联系下单店铺卖家 免费帮你查找封装; BOM名称: 光学定位点
R2-R4 R8-R16 R18 R21-R23 R33 R35 R46 R47 R49 R54 RFB1-RFB4 = R: 贴片电阻; 联系卖家，免费查找封装: 唯一出售店铺网址https://shop463601444.taobao.com; BOM名称: 贴片电阻
SPK+ SPK- TP2-TP7 = TEST: 测试点; 联系下单店铺卖家 免费技术支持: 联系下单店铺卖家 免费帮你查找封装; BOM名称: 测试点
SW1 = TD-1187SA-250: 小乌龟-侧按4脚开关 带定位柱; 联系下单店铺卖家 免费技术支持: 联系下单店铺卖家 免费帮你查找封装
U8 = ICM-42688-P: 6-axis MEMS
U12 = AP6212: WiFi & BT Module
U14 = CMP-04918-000139-2: IC REG CHARGE PUMP ADJ DL 12WSON; Min Output Voltage: 1.5V; Max Input Voltage: 5.5V; Synchronous Rectifier: No; Output Type: Adjustable; Output Current: 250mA; Min Input Voltage: 2.7V; Quiescent Current: 390uA; Switching Frequency: 2.3MHz; Max Output Voltage: 5V; Topology: Charge Pump; Lead Free: Lead Free; Min Operating Temperature: -40°C; Max Operating Temperature: 85°C; RoHS Compliant: Yes; Packaging: Tape and Reel; Mount: Surface Mount
U18 = CMP-12105-000030-1: MAINSTREAM ARM CORTEX-M4+ MCU 17; Manufacturer: STMicroelectronics; Number Of Adc Channels: 17; Number Of I/Os: 38; Standoff Height: 0.05mm; Number Of Usb Channels: 1; Data Bus Width: 32bits; Number Of I2C Channels: 3; Number Of Pwm Channels: 31; Frequency: 170MHz; Memory Type: FLASH; Number Of Timers/Counters: 14; Ram Size: 32KBytes; Max Junction Temp: +105°C; Memory Size: 128KBytes; Min Supply Voltage: 1.62V; Max Supply Voltage: 3.6V; Number Of Uart Channels: 4; Interface: I2C,SPI,UART,USART,CAN,USB,LIN,IrDA,I2S; Temperature Range Low: -40°C; Lead Free: Yes; Device Class L3: Microcontrollers; Number Of Cores: 1; Temperature Range High: +85°C; Height: 1.6mm; Digikey Description: MAINSTREAM ARM CORTEX-M4+ MCU 17; Device Class L1: Integrated Circuits (ICs); Package: LQFP48-5B; RoHS: TRUE; Number Of A/D Converters: 1; Core Architecture: Arm Cortex-M4; Device Class L2: Embedded Processors and Controllers; ComponentLink2Description: Datasheet; Temperature: -40°C to +85°C; Ambient Temperature Range High: +85°C; Ambient Temperature Range Low: -40°C; Octopart: https://octopart.com/stm32g431cbt6-stmicroelectronics-98835224; ComponentLink2URL: https://www.st.com/resource/en/datasheet/stm32g431cb.pdf; Automotive: No; Number Of Spi Channels: 3; Manufacturer Part Number: STM32G431CBT6; Category: IC
U19 = CMP-04918-000430-1: IC REG AMOLED DISPL 2OUT 12WSON; Number of Channels: 2; Max Supply Voltage: 5V; Min Supply Voltage: 2.9V; Output Voltage: -5V; Mount: Surface Mount; Case/Package: QFN; Packaging: Tape and Reel; Lead Free: Lead Free; Radiation Hardening: No; Min Operating Temperature: -40°C; Number of Outputs: 2; Max Operating Temperature: 85°C; Number of Pins: 12; RoHS Compliant: Yes; Package Quantity: 3000
U21 = CMP-1518-00018-3: IC PMIC BATT PWR SYST 48VQFN; Number of Outputs: 7; Output Current: 1.2A; Nominal Supply Current: 2.5A; Max Duty Cycle: 100%; Operating Supply Voltage: 5.8V; Output Voltage: 3.3V; Min Operating Temperature: -40°C; Radiation Hardening: No; Package Quantity: 2500; Number of Pins: 48; Mount: Surface Mount; Packaging: Tape and Reel; Lead Free: Lead Free; Max Operating Temperature: 105°C; Case/Package: VQFN; RoHS Compliant: Yes
U26 = CMP-05698-000018-1: IC AMP CLASS D MONO 3.2W 16TQFN; Max Supply Voltage: 5.5V; Max Output Current: 1.6A; Voltage Gain: 15dB; Max Power Dissipation: 1.666W; Min Supply Voltage: 2.5V; Power Supply Rejection Ratio (PSRR): 77dB; Series: -; Contact Plating: Tin; Min Operating Temperature: -40°C; Packaging: Tape and Reel; Max Output Power: 3.2W; Mount: Surface Mount; Number of Pins: 16; RoHS Compliant: Yes; Max Operating Temperature: 85°C; Radiation Hardening: No
USBC1 USBC2 = USB-Tyoe-C 16P-2.0: type-C-16pin
X3 = XTAL-2P: 2脚无源晶振(谐振器）; 联系下单店铺卖家 免费帮你查找封装: 联系下单店铺卖家 免费技术支持; BOM名称: 2脚无源晶振(谐振器）
X4 = XTAL-4P: 4脚无源晶振(谐振器）; 联系下单店铺卖家 免费帮你查找封装: 联系下单店铺卖家 免费技术支持; BOM名称: 4脚无源晶振(谐振器）

## Sheet MCU.SchDoc
size A3; SheetNumber: 3; SheetTotal: 9
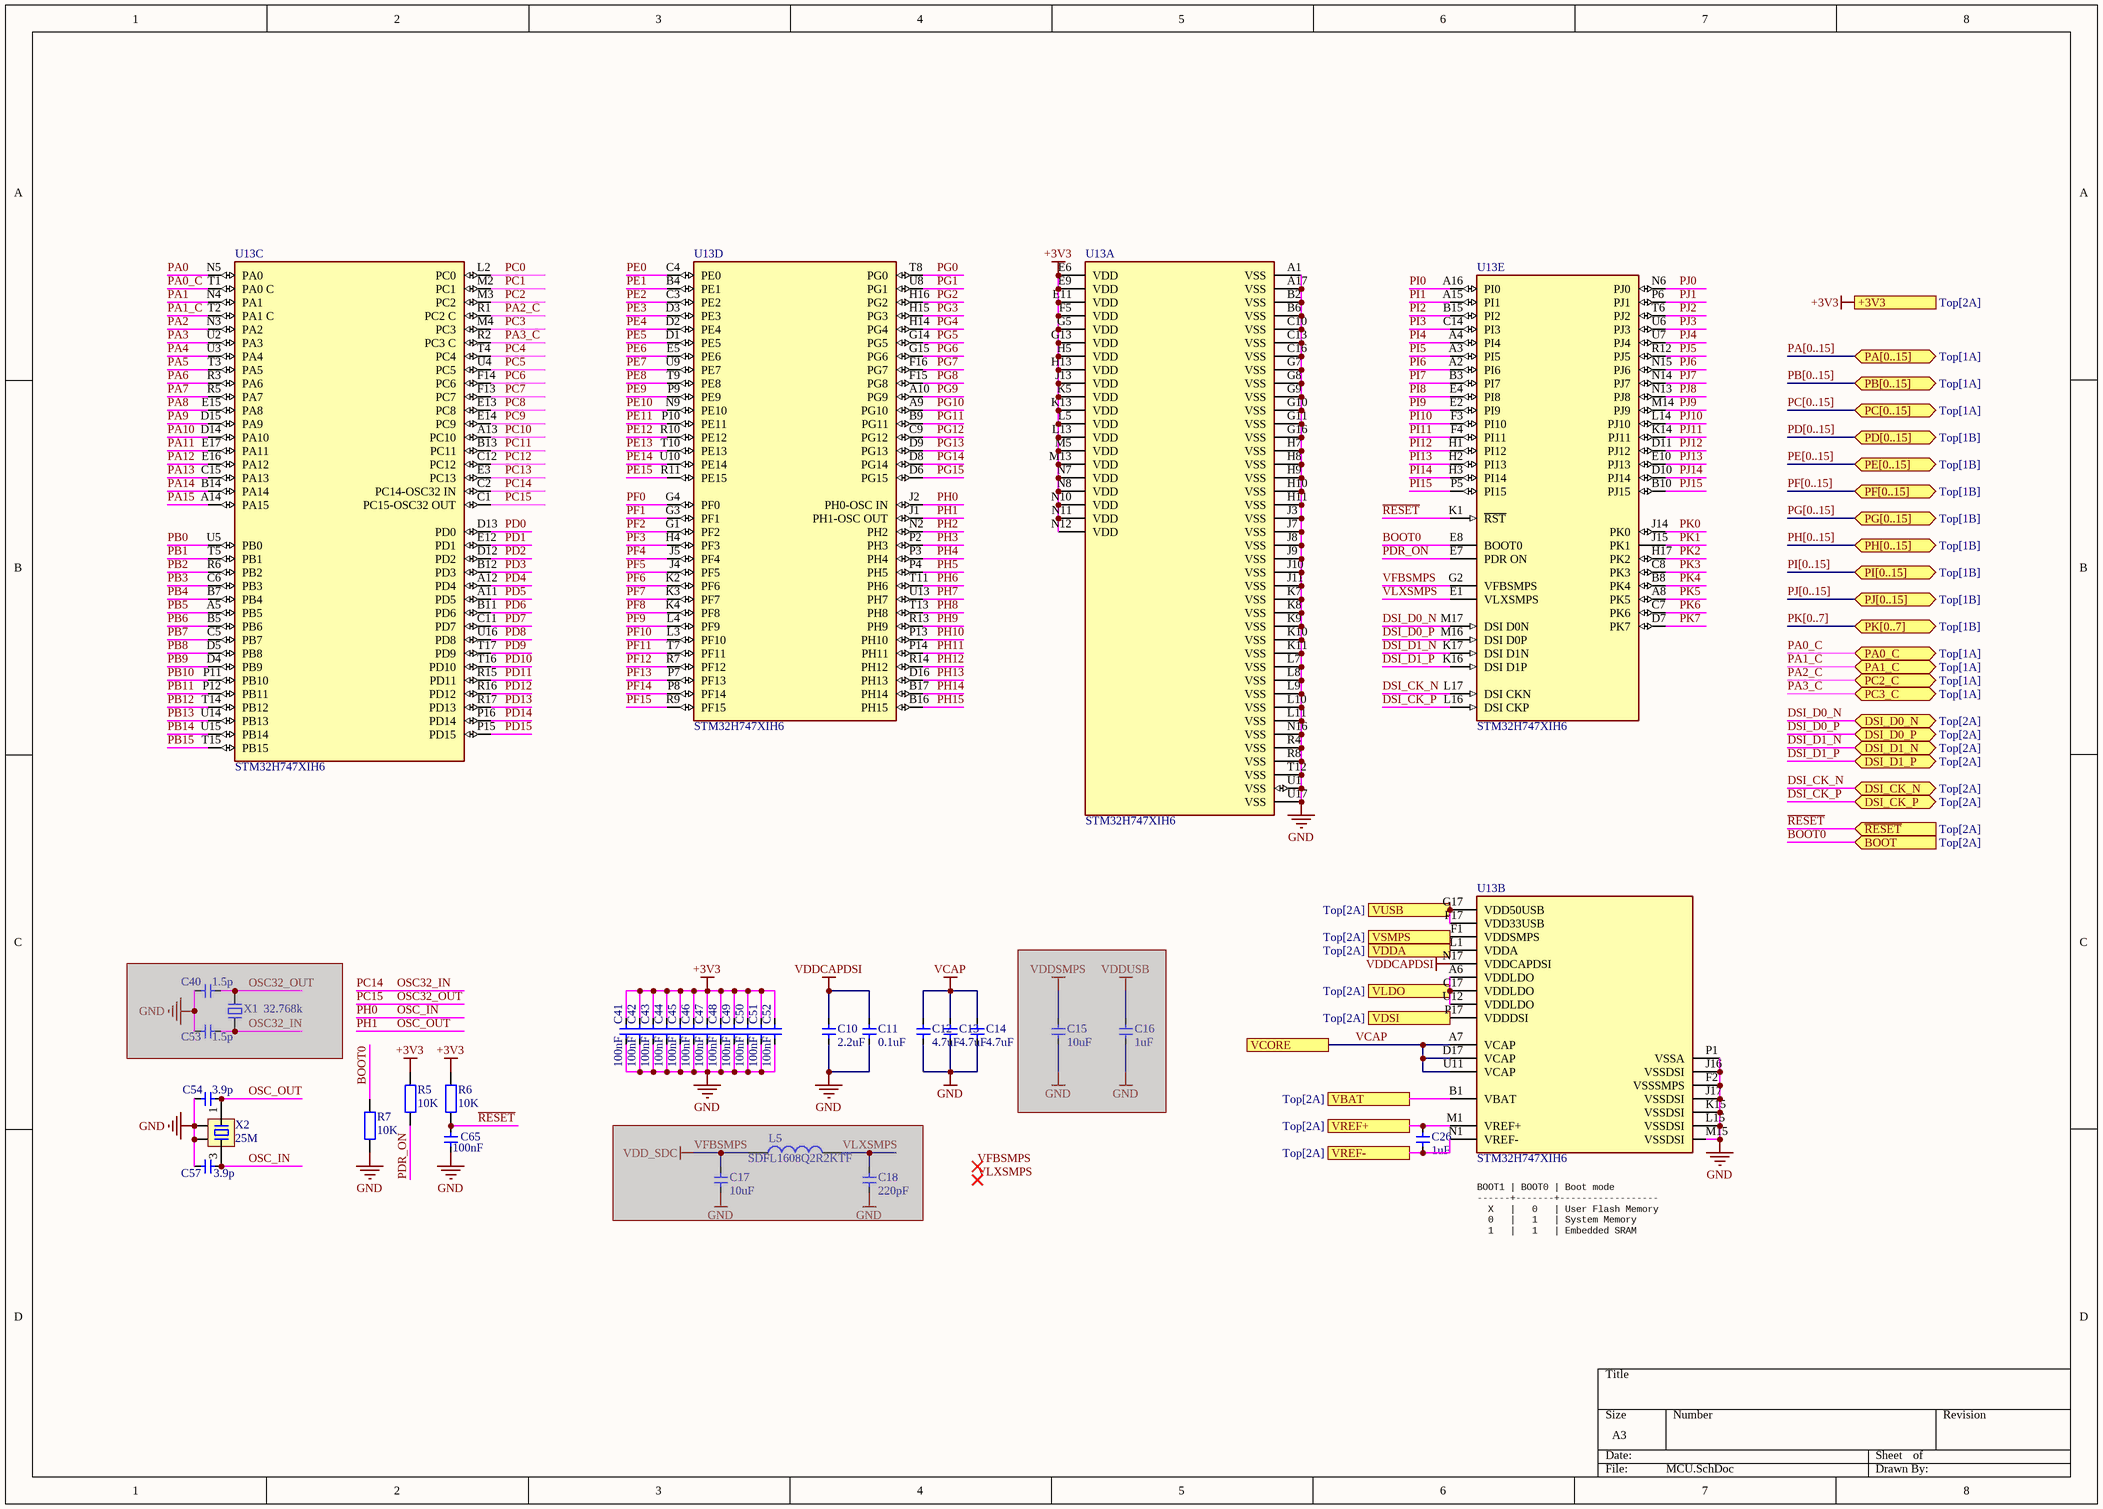
[diagram p3: MCU.SchDoc]

### Parts
(Parts that share a designator on the sheet are numbered #1, #2 ... from top to bottom, then left to right.)
C10  2.2uF  [0402-C]
C11  0.1uF  [0402-C]
C12  4.7uF  [0402-C]
C13  4.7uF  [0402-C]
C14  4.7uF  [0402-C]
C15#2  10uF  [0402-C]  (masked out: inside a compile mask, not in the netlist)
C16#2  1uF  [0402-C]  (masked out: inside a compile mask, not in the netlist)
C17#2  10uF  [0402-C]  (masked out: inside a compile mask, not in the netlist)
C18#2  220pF  [0402-C]  (masked out: inside a compile mask, not in the netlist)
C26  1uF  [0402-C]
C40  1.5p  [0402-C]  (masked out: inside a compile mask, not in the netlist)
C41  100nF  [0402-C]
C42  100nF  [0402-C]
C43  100nF  [0402-C]
C44  100nF  [0402-C]
C45  100nF  [0402-C]
C46  100nF  [0402-C]
C47  100nF  [0402-C]
C48  100nF  [0402-C]
C49  100nF  [0402-C]
C50  100nF  [0402-C]
C51  100nF  [0402-C]
C52  100nF  [0402-C]
C53  1.5p  [0402-C]  (masked out: inside a compile mask, not in the netlist)
C54  3.9p  [0402-C]
C57  3.9p  [0402-C]
C65  100nF  [0402-C]
L5#2  SDFL1608Q2R2KTF  [L0805]  (masked out: inside a compile mask, not in the netlist)
R5  10K  [0402-R]
R6  10K  [0402-R]
R7  10K  [0402-R]
U13  STM32H747XIH6  [FP-TFBGA240+25-A07U-MFG]  (parts A,B,C,D,E of 5)
X1  32.768k  [XTAL-3215-2P]  (masked out: inside a compile mask, not in the netlist)
X2  25M  [XTAL-3225-4P]

### Ports
+3V3 (see Top[2A]), BOOT (in, see Top[2A]), DSI_CK_N (bidir, see Top[2A]), DSI_CK_P (bidir, see Top[2A]), DSI_D0_N (bidir, see Top[2A]), DSI_D0_P (bidir, see Top[2A]), DSI_D1_N (bidir, see Top[2A]), DSI_D1_P (bidir, see Top[2A]), PA0_C (bidir, see Top[1A]), PA1_C (bidir, see Top[1A]), PA[0..15] (bidir, see Top[1A]), PB[0..15] (bidir, see Top[1A]), PC2_C (bidir, see Top[1A]), PC3_C (bidir, see Top[1A]), PC[0..15] (bidir, see Top[1A]), PD[0..15] (bidir, see Top[1B]), PE[0..15] (bidir, see Top[1B]), PF[0..15] (bidir, see Top[1B]), PG[0..15] (bidir, see Top[1B]), PH[0..15] (bidir, see Top[1B]), PI[0..15] (bidir, see Top[1B]), PJ[0..15] (bidir, see Top[1B]), PK[0..7] (bidir, see Top[1B]), VBAT (see Top[2A]), VCORE, VDDA (see Top[2A]), VDSI (see Top[2A]), VLDO (see Top[2A]), VREF+ (see Top[2A]), VREF- (see Top[2A]), VSMPS (see Top[2A]), VUSB (see Top[2A]), ~{RESET} (in, see Top[2A])

### Nets
+3V3: C41.1 C42.1 C43.1 C44.1 C45.1 C46.1 C47.1 C48.1 C49.1 C50.1 C51.1 C52.1 R5.2 R6.2 U13.E6(VDD) U13.E9(VDD) U13.E11(VDD) U13.F5(VDD) U13.G5(VDD) U13.G13(VDD) U13.H5(VDD) U13.H13(VDD) U13.J13(VDD) U13.K5(VDD) U13.K13(VDD) U13.L5(VDD) U13.L13(VDD) U13.M5(VDD) U13.M13(VDD) U13.N7(VDD) U13.N8(VDD) U13.N10(VDD) U13.N11(VDD) U13.N12(VDD) ; port +3V3  [project net VDCDC1]
GND: C10.1 C11.1 C12.1 C13.1 C14.1 C41.2 C42.2 C43.2 C44.2 C45.2 C46.2 C47.2 C48.2 C49.2 C50.2 C51.2 C52.2 C54.2 C57.2 C65.2 R7.1 U13.A1(VSS) U13.A17(VSS) U13.B2(VSS) U13.B6(VSS) U13.C10(VSS) U13.C13(VSS) U13.C16(VSS) U13.F2(VSSSMPS) U13.G7(VSS) U13.G8(VSS) U13.G9(VSS) U13.G10(VSS) U13.G11(VSS) U13.G16(VSS) U13.H7(VSS) U13.H8(VSS) U13.H9(VSS) U13.H10(VSS) U13.H11(VSS) U13.J3(VSS) U13.J7(VSS) U13.J8(VSS) U13.J9(VSS) U13.J10(VSS) U13.J11(VSS) U13.J16(VSSDSI) U13.J17(VSSDSI) U13.K7(VSS) U13.K8(VSS) U13.K9(VSS) U13.K10(VSS) U13.K11(VSS) U13.K15(VSSDSI) U13.L7(VSS) U13.L8(VSS) U13.L9(VSS) U13.L10(VSS) U13.L11(VSS) U13.L15(VSSDSI) U13.M15(VSSDSI) U13.N16(VSS) U13.P1(VSSA) U13.R4(VSS) U13.R8(VSS) U13.T12(VSS) U13.U1(VSS) U13.U17(VSS) X2.2 X2.4  [project net Audio_RT1]
VCAP: C12.2 C13.2 C14.2 U13.A7(VCAP) U13.D17(VCAP) U13.U11(VCAP) ; port VCORE
VDDCAPDSI: C10.2 C11.2 U13.N17(VDDCAPDSI)
BOOT0: R7.2 U13.E8(BOOT0) ; port BOOT
DSI_CK_N: U13.L17(DSI_CKN) ; port DSI_CK_N
DSI_CK_P: U13.L16(DSI_CKP) ; port DSI_CK_P
DSI_D0_N: U13.M17(DSI_D0N) ; port DSI_D0_N
DSI_D0_P: U13.M16(DSI_D0P) ; port DSI_D0_P
DSI_D1_N: U13.K17(DSI_D1N) ; port DSI_D1_N
DSI_D1_P: U13.K16(DSI_D1P) ; port DSI_D1_P
OSC32_IN: U13.C2(PC14-OSC32_IN)  [also labelled PC14]
OSC32_OUT: U13.C1(PC15-OSC32_OUT)  [also labelled PC15]
OSC_IN: C57.1 U13.J2(PH0-OSC_IN) X2.3  [also labelled PH0]
OSC_OUT: C54.1 U13.J1(PH1-OSC_OUT) X2.1  [also labelled PH1]
PA0: U13.N5(PA0)
PA0_C: U13.T1(PA0_C) ; port PA0_C
PA1: U13.N4(PA1)
PA1_C: U13.T2(PA1_C) ; port PA1_C
PA2: U13.N3(PA2)
PA2_C: U13.R1(PC2_C) ; port PC2_C
PA3: U13.U2(PA3)
PA3_C: U13.R2(PC3_C) ; port PC3_C
PA4: U13.U3(PA4)
PA5: U13.T3(PA5)
PA6: U13.R3(PA6)
PA7: U13.R5(PA7)
PA8: U13.E15(PA8)
PA9: U13.D15(PA9)
PA10: U13.D14(PA10)
PA11: U13.E17(PA11)
PA12: U13.E16(PA12)
PA13: U13.C15(PA13)
PA14: U13.B14(PA14)
PA15: U13.A14(PA15)
PB0: U13.U5(PB0)
PB1: U13.T5(PB1)
PB2: U13.R6(PB2)
PB3: U13.C6(PB3)
PB4: U13.B7(PB4)
PB5: U13.A5(PB5)
PB6: U13.B5(PB6)
PB7: U13.C5(PB7)
PB8: U13.D5(PB8)
PB9: U13.D4(PB9)
PB10: U13.P11(PB10)
PB11: U13.P12(PB11)
PB12: U13.T14(PB12)
PB13: U13.U14(PB13)
PB14: U13.U15(PB14)
PB15: U13.T15(PB15)
PC0: U13.L2(PC0)
PC1: U13.M2(PC1)
PC2: U13.M3(PC2)
PC3: U13.M4(PC3)
PC4: U13.T4(PC4)
PC5: U13.U4(PC5)
PC6: U13.F14(PC6)
PC7: U13.F13(PC7)
PC8: U13.E13(PC8)
PC9: U13.E14(PC9)
PC10: U13.A13(PC10)
PC11: U13.B13(PC11)
PC12: U13.C12(PC12)
PC13: U13.E3(PC13)
PD0: U13.D13(PD0)
PD1: U13.E12(PD1)
PD2: U13.D12(PD2)
PD3: U13.B12(PD3)
PD4: U13.A12(PD4)
PD5: U13.A11(PD5)
PD6: U13.B11(PD6)
PD7: U13.C11(PD7)
PD8: U13.U16(PD8)
PD9: U13.T17(PD9)
PD10: U13.T16(PD10)
PD11: U13.R15(PD11)
PD12: U13.R16(PD12)
PD13: U13.R17(PD13)
PD14: U13.P16(PD14)
PD15: U13.P15(PD15)
PDR_ON: R5.1 U13.E7(PDR_ON)
PE0: U13.C4(PE0)
PE1: U13.B4(PE1)
PE2: U13.C3(PE2)
PE3: U13.D3(PE3)
PE4: U13.D2(PE4)
PE5: U13.D1(PE5)
PE6: U13.E5(PE6)
PE7: U13.U9(PE7)
PE8: U13.T9(PE8)
PE9: U13.P9(PE9)
PE10: U13.N9(PE10)
PE11: U13.P10(PE11)
PE12: U13.R10(PE12)
PE13: U13.T10(PE13)
PE14: U13.U10(PE14)
PE15: U13.R11(PE15)
PF0: U13.G4(PF0)
PF1: U13.G3(PF1)
PF2: U13.G1(PF2)
PF3: U13.H4(PF3)
PF4: U13.J5(PF4)
PF5: U13.J4(PF5)
PF6: U13.K2(PF6)
PF7: U13.K3(PF7)
PF8: U13.K4(PF8)
PF9: U13.L4(PF9)
PF10: U13.L3(PF10)
PF11: U13.T7(PF11)
PF12: U13.R7(PF12)
PF13: U13.P7(PF13)
PF14: U13.P8(PF14)
PF15: U13.R9(PF15)
PG0: U13.T8(PG0)
PG1: U13.U8(PG1)
PG2: U13.H16(PG2)
PG3: U13.H15(PG3)
PG4: U13.H14(PG4)
PG5: U13.G14(PG5)
PG6: U13.G15(PG6)
PG7: U13.F16(PG7)
PG8: U13.F15(PG8)
PG9: U13.A10(PG9)
PG10: U13.A9(PG10)
PG11: U13.B9(PG11)
PG12: U13.C9(PG12)
PG13: U13.D9(PG13)
PG14: U13.D8(PG14)
PG15: U13.D6(PG15)
PH2: U13.N2(PH2)
PH3: U13.P2(PH3)
PH4: U13.P3(PH4)
PH5: U13.P4(PH5)
PH6: U13.T11(PH6)
PH7: U13.U13(PH7)
PH8: U13.T13(PH8)
PH9: U13.R13(PH9)
PH10: U13.P13(PH10)
PH11: U13.P14(PH11)
PH12: U13.R14(PH12)
PH13: U13.D16(PH13)
PH14: U13.B17(PH14)
PH15: U13.B16(PH15)
PI0: U13.A16(PI0)
PI1: U13.A15(PI1)
PI2: U13.B15(PI2)
PI3: U13.C14(PI3)
PI4: U13.A4(PI4)
PI5: U13.A3(PI5)
PI6: U13.A2(PI6)
PI7: U13.B3(PI7)
PI8: U13.E4(PI8)
PI9: U13.E2(PI9)
PI10: U13.F3(PI10)
PI11: U13.F4(PI11)
PI12: U13.H1(PI12)
PI13: U13.H2(PI13)
PI14: U13.H3(PI14)
PI15: U13.P5(PI15)
PJ0: U13.N6(PJ0)
PJ1: U13.P6(PJ1)
PJ2: U13.T6(PJ2)
PJ3: U13.U6(PJ3)
PJ4: U13.U7(PJ4)
PJ5: U13.R12(PJ5)
PJ6: U13.N15(PJ6)
PJ7: U13.N14(PJ7)
PJ8: U13.N13(PJ8)
PJ9: U13.M14(PJ9)
PJ10: U13.L14(PJ10)
PJ11: U13.K14(PJ11)
PJ12: U13.D11(PJ12)
PJ13: U13.E10(PJ13)
PJ14: U13.D10(PJ14)
PJ15: U13.B10(PJ15)
PK0: U13.J14(PK0)
PK1: U13.J15(PK1)
PK2: U13.H17(PK2)
PK3: U13.C8(PK3)
PK4: U13.B8(PK4)
PK5: U13.A8(PK5)
PK6: U13.C7(PK6)
PK7: U13.D7(PK7)
~{RESET}: C65.1 R6.1 U13.K1(~{RST}) ; port ~{RESET}
VFBSMPS: U13.G2(VFBSMPS)
VLXSMPS: U13.E1(VLXSMPS)
NetC26_1: C26.1 U13.N1(VREF-) ; port VREF-
NetC26_2: C26.2 U13.M1(VREF+) ; port VREF+
NetU13_A6: U13.A6(VDDLDO) U13.C17(VDDLDO) U13.U12(VDDLDO) ; port VLDO
NetU13_B1: U13.B1(VBAT) ; port VBAT
NetU13_F1: U13.F1(VDDSMPS) ; port VSMPS
NetU13_F17: U13.F17(VDD33USB) U13.G17(VDD50USB) ; port VUSB
NetU13_L1: U13.L1(VDDA) ; port VDDA
NetU13_P17: U13.P17(VDDDSI) ; port VDSI

### Buses and harness runs
bus PA[0..15] = port PA[0..15]
bus PB[0..15] = port PB[0..15]
bus PC[0..15] = port PC[0..15]
bus PD[0..15] = port PD[0..15]
bus PE[0..15] = port PE[0..15]
bus PF[0..15] = port PF[0..15]
bus PG[0..15] = port PG[0..15]
bus PH[0..15] = port PH[0..15]
bus PI[0..15] = port PI[0..15]
bus PJ[0..15] = port PJ[0..15]
bus PK[0..7] = port PK[0..7]

### Notes on the sheet
- Ceramic capacitor (Low ESR <600m ohm)
- BOOT1 | BOOT0 | Boot mode
  ------+-------+------------------
  X   |   0   | User Flash Memory
  0   |   1   | System Memory
  1   |   1   | Embedded SRAM
- Labels drawn without touching a wire or pin: VFBSMPS, VLXSMPS

### Library data of the parts
C10-C14 C15#2 C16#2 C17#2 C18#2 C26 C40-C54 C57 C65 = 电容-0402: Capacitor; Value: 0.1u
L5#2 = L: as L1 on sheet Top
R5-R7 = R: as R2 on sheet Top; BOM名称: 贴片电阻
U13 = CMP-12105-000055-1: HIGH-PERFORMANCE AND DSP WITH DP; Manufacturer: STMicroelectronics; Number Of Uart Channels: 9; Number Of Pwm Channels: 2; Memory Size: 2MBytes; Number Of Ethernet Channels: 1; Ram Size: 1MBytes; Number Of Timers/Counters: 22; Data Bus Width: 32bits; Core Architecture: ARM Cortex-M4, ARM Cortex-M7; Interface: I2C,SPI,UART,USART,CAN,USB,LIN,IrDA,Ethernet,I2S,SMBus,Other; Number Of Adc Channels: 36; Min Supply Voltage: 1.2V; Number Of A/D Converters: 3; Number Of Spi Channels: 6; Max Supply Voltage: 3.6V; Frequency: 480MHz; Memory Type: FLASH; Number Of I2C Channels: 4; Max Junction Temp: +125°C; Standoff Height: 0.15mm; Number Of I/Os: 168; Device Class L2: Embedded Processors and Controllers; Digikey Description: HIGH-PERFORMANCE AND DSP WITH DP; RoHS: TRUE; Lead Free: Yes; Manufacturer Part Number: STM32H747XIH6; ComponentLink2URL: https://www.st.com/resource/en/datasheet/stm32h747xi.pdf; Mouser Description: STM32 Series 2 MB Flash 1 MB RAM 480 MHz 32-Bit Microcontroller - TFBGA-265; Device Class L1: Integrated Circuits (ICs); Ipc Land Pattern Name: BGA289N80P17X17_1400X1400X110; Category: IC; Device Class L3: Microcontrollers; Ambient Temperature Range High: +85°C; Number Of Cores: 2; Temperature Range High: +125°C; ComponentLink2Description: Datasheet; Automotive: No; Ambient Temperature Range Low: -40°C; Package: TFBGA240+25-A07U; Temperature: -40°C to +125°C; Number Of Usb Channels: 2; Temperature Range Low: -40°C; Height: 1.1mm; Octopart: https://octopart.com/stm32h747xih6-stmicroelectronics-100293943
X1 = XTAL-2P: as X3 on sheet Top; BOM名称: 2脚无源晶振(谐振器）
X2 = XTAL-4P: as X4 on sheet Top; BOM名称: 4脚无源晶振(谐振器）

## Sheet AFE.SchDoc
size A4; SheetNumber: 4; SheetTotal: 9
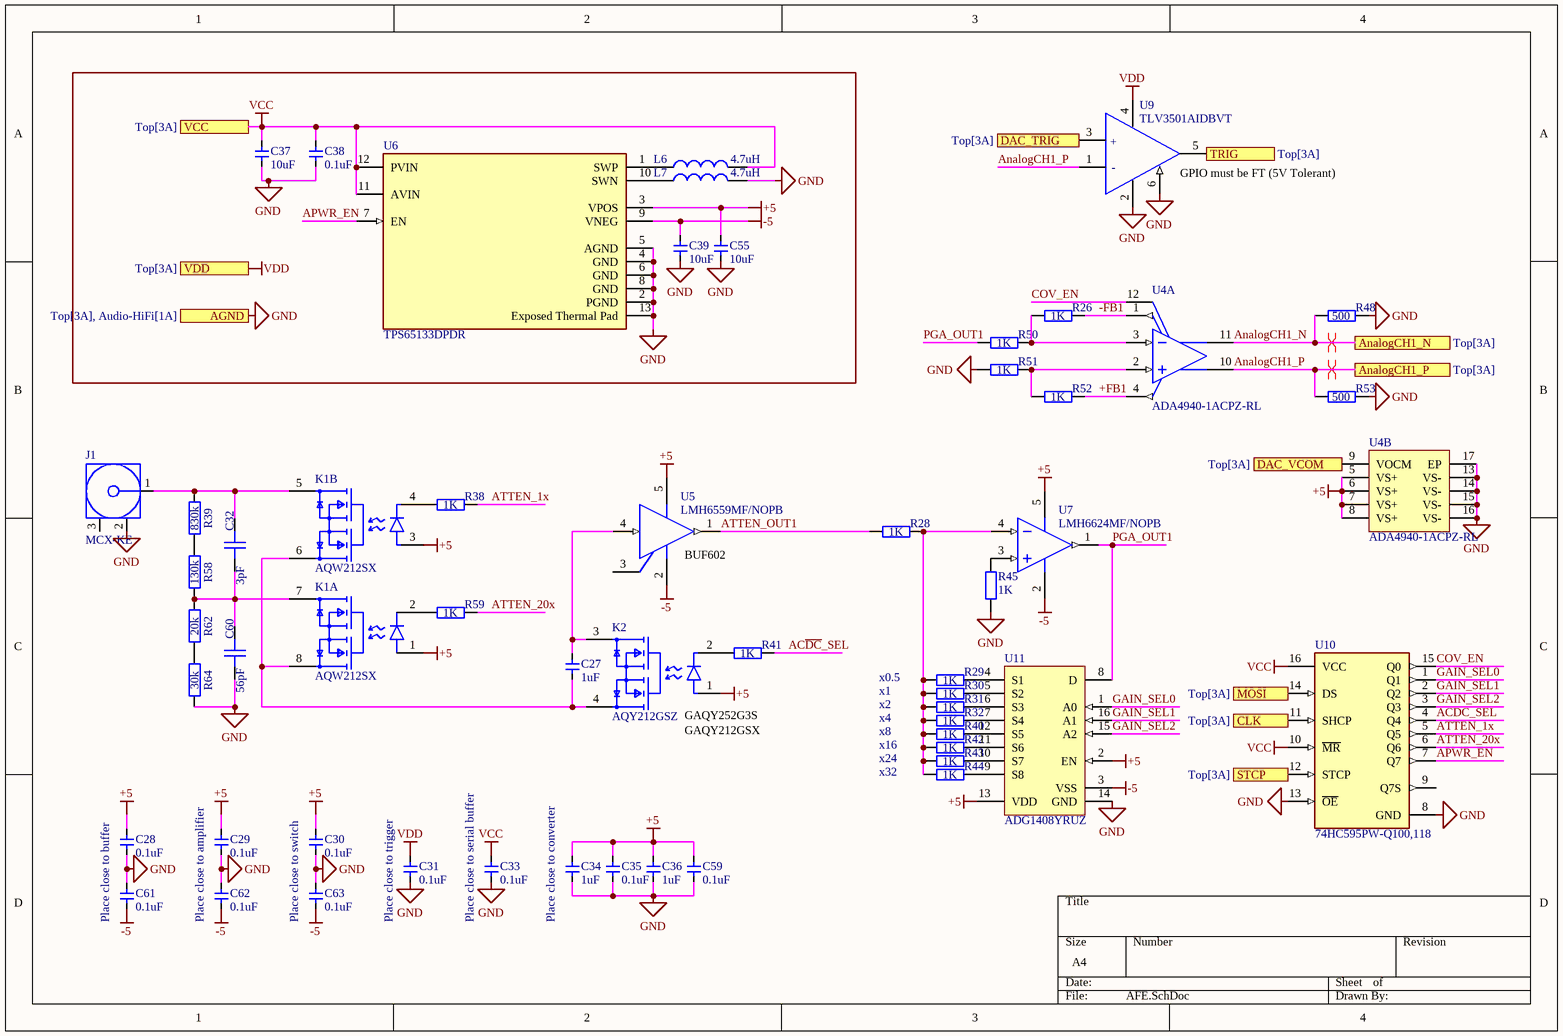
[diagram p4: AFE.SchDoc]

### Parts
C27  1uF  [0402-C]
C28  0.1uF  [0402-C]
C29  0.1uF  [0402-C]
C30  0.1uF  [0402-C]
C31  0.1uF  [0402-C]
C32  3pF  [0402-C]
C33  0.1uF  [0402-C]
C34  1uF  [0402-C]
C35  0.1uF  [0402-C]
C36  1uF  [0402-C]
C37  10uF  [0402-C]
C38  0.1uF  [0402-C]
C39  10uF  [0402-C]
C55  10uF  [0402-C]
C59  0.1uF  [0402-C]
C60  56pF  [0402-C]
C61  0.1uF  [0402-C]
C62  0.1uF  [0402-C]
C63  0.1uF  [0402-C]
J1  MCX-KE  [60612202111308]
K1  AQW212SX  [FP-AQW212SX-MFG]  (parts A,B of 2)
K2  AQY212GSZ  [FP-AQY212GSZ-MFG]
L6  4.7uH  [L0805]
L7  4.7uH  [L0805]
R26  1K  [0402-R]
R28  1K  [0402-R]
R29  1K  [0402-R]
R30  1K  [0402-R]
R31  1K  [0402-R]
R32  1K  [0402-R]
R38  1K  [0402-R]
R39  830k  [0402-R]
R40  1K  [0402-R]
R41  1K  [0402-R]
R42  1K  [0402-R]
R43  1K  [0402-R]
R44  1K  [0402-R]
R45  1K  [0402-R]
R48  500  [0402-R]
R50  1K  [0402-R]
R51  1K  [0402-R]
R52  1K  [0402-R]
R53  500  [0402-R]
R58  130k  [0402-R]
R59  1K  [0402-R]
R62  20k  [0402-R]
R64  30k  [0402-R]
U4  ADA4940-1ACPZ-RL  [ADI-CP-16-2_M]  (parts A,B of 2)
U5  LMH6559MF/NOPB  [DBV0005A_L]
U6  TPS65133DPDR  [FP-DPD0012A-MFG]
U7  LMH6624MF/NOPB  [DBV0005A_L]
U9  TLV3501AIDBVT  [FP-DBV0006A-MFG]
U10  74HC595PW-Q100,118  [FP-SOT403-1-MFG]
U11  ADG1408YRUZ  [ADI-RU-16_N]

### Ports
AGND (see Top[3A], Audio-HiFi[1A]), AnalogCH1_N (see Top[3A]), AnalogCH1_P (see Top[3A]), CLK (in, see Top[3A]), DAC_TRIG (see Top[3A]), DAC_VCOM (see Top[3A]), MOSI (in, see Top[3A]), STCP (in, see Top[3A]), TRIG (out, see Top[3A]), VCC (see Top[3A]), VDD (see Top[3A])

### Nets
+5: C28.2 C29.2 C30.2 C34.2 C35.2 C36.2 C55.2 C59.2 K1.1(1_ANODE) K1.3(2_ANODE) K2.1(A) U4.5(VS+) U4.6(VS+) U4.7(VS+) U4.8(VS+) U5.5(VCC) U6.3(VPOS) U7.5(V+) U11.2(EN) U11.13(VDD)
-5: C39.2 C61.1 C62.1 C63.1 U5.2(VEE) U6.9(VNEG) U7.2(V-) U11.3(VSS)
GND: C28.1 C29.1 C30.1 C31.2 C33.2 C34.1 C35.1 C36.1 C37.1 C38.1 C39.1 C55.1 C59.1 C60.1 C61.2 C62.2 C63.2 J1.2(GND) L7.2 R45.2 R48.1 R51.2 R53.1 R64.1 U4.13(VS-) U4.14(VS-) U4.15(VS-) U4.16(VS-) U4.17(EP) U6.2(PGND) U6.4(GND) U6.5(AGND) U6.6(GND) U6.8(GND) U6.13(Exposed_Thermal_Pad) U9.2(V-) U9.6(SHDN) U10.8(GND) U10.13(~{OE}) U11.14(GND) ; port AGND  [project net Audio_RT1]
VCC: C33.1 C37.2 C38.2 L6.2 U6.11(AVIN) U6.12(PVIN) U10.10(~{MR}) U10.16(VCC) ; port VCC
VDD: C31.1 U9.4(V+) ; port VDD
+FB1: R52.1 U4.4(FB+)
-FB1: R26.1 U4.1(FB-)
AC~{DC}_SEL: R41.1 U10.4(Q4)
AnalogCH1_N: R48.2 U4.11(OUT-) ; port AnalogCH1_N
AnalogCH1_P: R53.2 U4.10(OUT+) U9.1(-IN) ; port AnalogCH1_P
APWR_EN: U6.7(EN) U10.7(Q7)
ATTEN_1x: R38.1 U10.5(Q5)
ATTEN_20x: R59.1 U10.6(Q6)
ATTEN_OUT1: R28.2 U5.1(OUT)
COV_EN: U4.12(~{DISABLE}) U10.15(Q0)
GAIN_SEL0: U10.1(Q1) U11.1(A0)
GAIN_SEL1: U10.2(Q2) U11.16(A1)
GAIN_SEL2: U10.3(Q3) U11.15(A2)
PGA_OUT1: R50.2 U7.1(OUT) U11.8(D)
NetC27_1: C27.1 K2.3(1_DRAIN) U5.4(IN)
NetC27_2: C27.2 K1.6(2_2_DRAIN) K1.8(1_2_DRAIN) K2.4(2_DRAIN)
NetC32_1: C32.1 C60.2 K1.7(1_1_DRAIN) R58.1 R62.2
NetC32_2: C32.2 J1.1(Signal) K1.5(2_1_DRAIN) R39.2
NetK1_2: K1.2(1_CATHODE) R59.2
NetK1_4: K1.4(2_CATHODE) R38.2
NetK2_2: K2.2(C) R41.2
NetL6_1: L6.1 U6.1(SWP)
NetL7_1: L7.1 U6.10(SWN)
NetR26_2: R26.2 R50.1 U4.3(IN-)
NetR28_1: R28.1 R29.2 R30.2 R31.2 R32.2 R40.2 R42.2 R43.2 R44.2 U7.4(IN-)
NetR29_1: R29.1 U11.4(S1)
NetR30_1: R30.1 U11.5(S2)
NetR31_1: R31.1 U11.6(S3)
NetR32_1: R32.1 U11.7(S4)
NetR39_1: R39.1 R58.2
NetR40_1: R40.1 U11.12(S5)
NetR42_1: R42.1 U11.11(S6)
NetR43_1: R43.1 U11.10(S7)
NetR44_1: R44.1 U11.9(S8)
NetR45_1: R45.1 U7.3(IN+)
NetR51_1: R51.1 R52.2 U4.2(IN+)
NetR62_1: R62.1 R64.2
NetU1_6: U10.11(SHCP) ; port CLK
NetU4_9: U4.9(VOCM) ; port DAC_VCOM
NetU9_3: U9.3(+IN) ; port DAC_TRIG
NetU9_5: U9.5(OUT) ; port TRIG
NetU10_12: U10.12(STCP) ; port STCP
NetU10_14: U10.14(DS) ; port MOSI

Not connected (* = marked no-connect by the designer): J1 3(GND); U5 3(NC); U10 9(Q7S)

### Layout directives
differential pair: AnalogCH1_N, AnalogCH1_P

### Notes on the sheet
- (near U9) GPIO must be FT (5V Tolerant)
- (near U5) BUF602
- 要让分压器的幅频响应在宽带内尽量平坦，常用方法是让电阻比与电容比互为倒数，使得上、下分支的极点对齐（time-constant 比例匹配）。
  满足 Rtop / Rbot = Cbot / Ctop
  即Ctop = Cbot * (Rbot / Rtop)
  -3dB截止频率：
  fc = 1 / 2πRbotCbot
- (near K2) GAQY252G3S
- x0.5
- x1
- x2
- x4
- (near K2) GAQY212GSX
- x8
- x16
- x24
- x32
- Place close to buffer
- Place close to amplifier
- Place close to switch
- (near C31) Place close to trigger
- (near C33) Place close to serial buffer
- (near C34) Place close to converter
- (in symbol CMP-04896-000031-1) +; -

### Library data of the parts
C27-C31 C33-C39 C55 C59 C61-C63 = 电容-0402: Capacitor; Value: 0.1u
C32 C60 = CAP 240pF 250V C0G 0805: Manufacturer: Kyocera AVX; Manufacturer Part Number: 600F241FT250XT; Voltage Rating: 250V; Temperature Coefficient: C0G; Package: 0805; Supplier 1: Mouser; Supplier Part Number 1: 581-600F241FT
  C32: Value: 3pF
  C60: Value: 56pF
J1 = CMP-03913-103226999-1: 60612202111308 WR-MCX_MCX PCB End Launch Jack; Insulation Resistance: 1GΩ; Insertion Loss (dB): 0.25dB; Impedance: 50Ω; NexarPartId: 103226999; Packaging: Tape and Reel; Min Operating Temperature: -55°C; Insulation Material: PTFE; Max Operating Temperature: 155°C; RoHS: Compliant
K1 = CMP-00287-06029784-1: AQW212SX Mosfet Relay, Dpst-No, 0.4A, 60V, Sop-8 Rohs Compliant: Yes; Isolation Voltage: 1.5kV; Max Power Dissipation: 650mW; Output Voltage: 48V; Throw Configuration: DPST; Output Current: 400mA; Input Current: 3mA; Number of Contacts: 2; Resistance: 2.5Ω; Max Junction Temperature (Tj): 125°C; On-State Resistance: 830mΩ; Capacitance: 800fF; Radiation Hardening: No; Packaging: Tape & Reel (TR); Max Output Voltage: 60V; Ambient Temperature Range High: 85°C; NexarPartId: 6029784; Mount: Surface Mount; Load Current: 400mA; Case/Package: SOP; Termination: Gull Wing; Height: 2.3mm; Relay Type: Relay; Min Operating Temperature: -40°C; RoHS: Compliant; Max Operating Temperature: 85°C
K2 = CMP-00287-00695292-1: AQY212GSZ Relay Ssr 50MA 1.5V Dc-in 1A 60V Ac/dc-out 4-PIN Sop T/r; NexarPartId: 695292; Forward Current: 1.1mA; Capacitance: 800fF; On-State Resistance: 340mΩ; Max Power Dissipation: 450mW; Isolation Voltage: 1.5kV; Number of Contacts: 1; Output Voltage: 48V; Throw Configuration: SPST; Resistance: 700mΩ; Input Current: 30mA; Width: 4.3mm; Case/Package: SOP; REACH SVHC: No SVHC; Max Operating Temperature: 85°C; Packaging: Tape & Reel (TR); Output Current: 1A; Max Output Current: 1A; Relay Type: Relay; RoHS: Compliant; Termination: Gull Wing; Radiation Hardening: No; Lead Free: Lead Free; Length: 4.4mm; Ambient Temperature Range High: 85°C; Number of Pins: 4; Max Input Current: 50mA; Height: 2.1mm; Load Current: 1A; Min Operating Temperature: -40°C; Max Input Voltage: 1.5V; Max Output Voltage: 60V; Mount: Surface Mount
L6 L7 = L: as L1 on sheet Top
R26 R28-R32 R38 R40-R45 R48 R50-R53 R59 = R: as R2 on sheet Top; BOM名称: 贴片电阻
R39 R58 R62 R64 = RES 20K OHM 1% 1/16W 0402: Manufacturer: Yageo; Manufacturer Part Number: RC0402FR-0720KL; Tolerance: 1%; Package: 0402; Supplier 1: Mouser; Supplier Part Number 1: 603-RC0402FR-0720KL
  R39: Value: 830k
  R58: Value: 130k
  R62: Value: 20k
  R64: Value: 30k
U4 = CMP-1348-00002-1: Ultralow Power, Low Distortion Fully Differential ADC Driver, 3 to 7 V, -40 to 125 degC, 16-Pin LFCSP_VQ (CP-16-2), RoHS, Reel; Manufacturer: Analog Devices; Slew Rate: 95 V/us Typ.; Operating Range: 3 to 7 V; -3dB Bandwidth: 260 MHz Typ.; Test Frequency: 0.05 MHz; Iq/Amp: 1.18 mA Typ.; ComponentLink2Description: Datasheet; Packing: Reel; RoHS: TRUE; DatasheetVersion: Rev. C; ComponentLink1Description: Manufacturer URL; ComponentLink3Description: Package Specification; PackageVersion: Jan-05; ComponentLink3URL: http://www.analog.com/static/imported-files/packages/PKG_PDF/LFCSP(CP)/CP_16_2.pdf; PackageDescription: 16-Pin Lead Frame Chip Scale Package, Body 3 x 3 mm, Pitch 0.5 mm; ComponentLink2URL: http://www.analog.com/static/imported-files/data_sheets/ADA4940-1_4940-2.pdf; PartNumber: ADA4940-1ACPZ-RL; ComponentLink1URL: http://www.analog.com/en/index.html; Mounting Technology: Surface Mount; Temperature Range: -40 to 125 degC
U5 = CMP-0055-01263-3: High-Speed, Closed-Loop Buffer, 5-pin SOT-23, Pb-Free; Manufacturer: Texas Instruments; CompType: Amplifiers; PowerWise: N; PackageTopMarking: B05A*XTT; ComponentLink1URL: http://www.ti.com/general/docs/lit/getliterature.tsp?genericPartNumber=LMH6559&fileType=pdf; PackageDescription: Molded SOT-23, .115 x .063 x .040 in Body, 5 Lead, .0375 in Pitch; ComponentLink1Description: Datasheet URL; RoHS: Y; Package Reference: DBV0005A; PinCount: 5
U6 = CMP-04918-000430-1: as U19 on sheet Top; Mount: Surface Mount; Case/Package: QFN; Packaging: Tape and Reel; Lead Free: Lead Free; Radiation Hardening: No; Min Operating Temperature: -40°C; Number of Outputs: 2; Max Operating Temperature: 85°C; Number of Pins: 12; RoHS Compliant: Yes; Package Quantity: 3000
U7 = CMP-0055-01252-3: Single/ Dual Ultra Low Noise Wideband Operational Amplifier, 5-pin SOT-23, Pb-Free; Manufacturer: Texas Instruments; CompType: Amplifiers; PowerWise: Y; PackageTopMarking: A94A*XTT; PinCount: 5; ComponentLink1URL: http://www.ti.com/general/docs/lit/getliterature.tsp?genericPartNumber=LMH6624&fileType=pdf; RoHS: Y; Package Reference: DBV0005A; ComponentLink1Description: Datasheet URL; PackageDescription: Molded SOT-23, .115 x .063 x .040 in Body, 5 Lead, .0375 in Pitch
U9 = CMP-04896-000031-1: IC COMP 4.5NS R-R HS SOT23-6; Manufacturer: Texas Instruments; Input Bias Current: 0.000002uA; Input Offset Voltage: 1mV; Number Of Channels: 1; Max Junction Temp: +150°C; Standoff Height: 0mm; Output Current Per Channel: 74mA; Min Supply Voltage: 2.2V; Min Dual Supply Voltage: 1.35V; Max Supply Voltage: 5.5V; Max Dual Supply Voltage: 2.75V; Nominal Supply Current: 3.2mA; Temperature: -40°C to +125°C; Manufacturer Part Number: TLV3501AIDBVT; ComponentLink2URL: https://www.ti.com/lit/ds/symlink/tlv3501.pdf; Ambient Temperature Range Low: -40°C; ComponentLink2Description: Datasheet; Package: DBV0006A; Temperature Range High: +125°C; Mouser Description: Analog Comparators 4.5ns Rail-to-Rail High Speed; RoHS: TRUE; Ambient Temperature Range High: +125°C; Device Class L1: Integrated Circuits (ICs); Device Class L2: Linear ICs; Automotive: No; Height: 1.45mm; Octopart: https://octopart.com/tlv3501aidbvt-texas+instruments-428399; Digikey Description: IC COMP 4.5NS R-R HS SOT23-6; Category: IC; Lead Free: Yes; Device Class L3: Comparators; Temperature Range Low: -40°C
U10 = CMP-14351-000002-1: IC SHIFT REGISTER 8BIT 16TSSOP; Manufacturer: Nexperia; Nominal Supply Current: 160uA; Max Supply Voltage: 6V; Standoff Height: 0.05mm; Automotive Grade: Grade 1; Number Of Circuits: 1; Min Supply Voltage: 2V; Frequency: 108MHz; Number Of Outputs: 9; Propagation Delay: 16ns; Ambient Temperature Range Low: -40°C; Device Class L3: Shift Registers; Device Class L2: Logic ICs; RoHS: TRUE; Footprint Url: https://assets.nexperia.com/documents/outline-drawing/SOT403-1.pdf; ComponentLink2URL: https://assets.nexperia.com/documents/data-sheet/74HC_HCT595_Q100.pdf; Digikey Description: IC SHIFT REGISTER 8BIT 16TSSOP; Manufacturer Part Number: 74HC595PW-Q100,118; Automotive: Yes; Temperature Range High: +125°C; Temperature Range Low: -40°C; Height: 1.1mm; Ambient Temperature Range High: +125°C; Package: SOT403-1; ComponentLink2Description: Datasheet; Octopart: https://octopart.com/74hc595pw-q100%2C118-nexperia-78737379; Number Of Inputs: 1; Ipc Land Pattern Name: SOP65P500X110-16; Lead Free: Yes; Device Class L1: Integrated Circuits (ICs); Category: IC; Temperature: -40°C to +125°C
U11 = CMP-0793-00127-1: 4 Ohm Ron, 8-Channel +/-15 V / +12 V / +/-5 V iCMOS Multiplexer, 16-pin SOP (RU-16), Tube; Manufacturer: Analog Devices; Max Analog Signal Range: Vss to Vdd; Ron (ohms): 4; t transition (s): 140n; Bandwidth (Hz): 60M, 36M, 40M; PackageDescription: 16-Pin Thin Shrink Small Outline Package, Body 5 x 4.4 mm, Pitch 0.65 mm; DatasheetVersion: Rev. B; ComponentLink3URL: http:/www.analog.com/static/imported-files/packages/36244347913743854010197452789RU16.pdf; ComponentLink2Description: Datasheet; ComponentLink1URL: http://www.analog.com/en/index.html; ComponentLink2URL: http://www.analog.com/static/imported-files/data_sheets/ADG1408_1409.pdf; Code_JEDEC: MO-153AB; Mounting Technology: Surface Mount; ComponentLink1Description: Manufacturer URL; Packing: Tube; ComponentLink3Description: Package Specification; PackageReference: RU-16; PartNumber: ADG1408YRUZ; PackageVersion: Nov-02

## Sheet Nor Flash QSPI.SchDoc
size A4; SheetNumber: 5; SheetTotal: 16
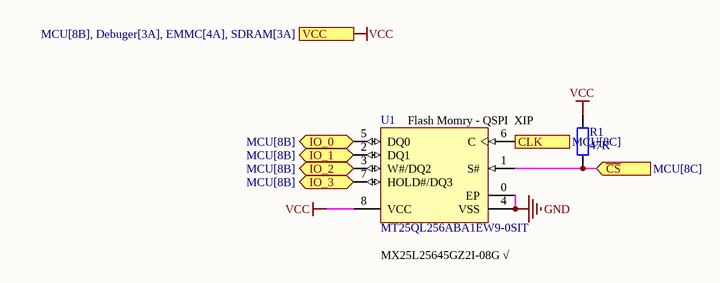
[diagram p5: Nor Flash QSPI.SchDoc]

### Parts
R1  47K  [0402-R]
U1  MT25QL256ABA1EW9-0SIT  [WSON8]

### Ports
CLK (in, see MCU[8C]), IO_0 (bidir, see MCU[8B]), IO_1 (bidir, see MCU[8B]), IO_2 (bidir, see MCU[8B]), IO_3 (bidir, see MCU[8B]), VCC (see MCU[8B], Debuger[3A], EMMC[4A], SDRAM[3A]), ~{CS} (in, see MCU[8C])

### Nets
GND: U1.0(EP) U1.4(VSS)  [project net Audio_RT1]
VCC: R1.1 U1.8(VCC) ; port VCC
NetR1_2: R1.2 U1.1(S#) ; port ~{CS}
NetU1_2: U1.2(DQ1) ; port IO_1
NetU1_3: U1.3(W#/DQ2) ; port IO_2
NetU1_5: U1.5(DQ0) ; port IO_0
NetU1_6: U1.6(C) ; port CLK
NetU1_7: U1.7(HOLD#/DQ3) ; port IO_3

### Notes on the sheet
- (near U1) Flash Momry - QSPI  XIP
- (near U1) MX25L25645GZ2I-08G √

### Library data of the parts
R1 = R: as R2 on sheet Top; BOM名称: 贴片电阻
U1 = MT25QL256ABA1EW9-0SIT: Micron Serial NOR Flash Memory, 2.7 to 3.6 V, 256 Mb, -40 to 85 degC, 8-Pin W-PDFN (W9), RoHS; Manufacturer: Micron Technology; Datasheet URL: https://www.micron.com/~/media/documents/products/data-sheet/nor-flash/serial-nor/mt25q/die-rev-a/mt25q_qljs_l_256_aba_0.pdf; Manufacturer URL: http://www.micron.com/; RoHSCompliant: true; Datasheet Version: Rev. I, 07/2017; Mounting Technology: SurfaceMount; Package Reference: W9; Package Description: 8-Pin Plastic Dual Flat No-lead Package, Body 8 x 6 mm, Pitch 1.27 mm; Manufacturer Part Number: MT25QL256ABA1EW9-0SIT